# Altium schematic sheet Full bridge-2-Buck drives -9.SchDoc
size A0
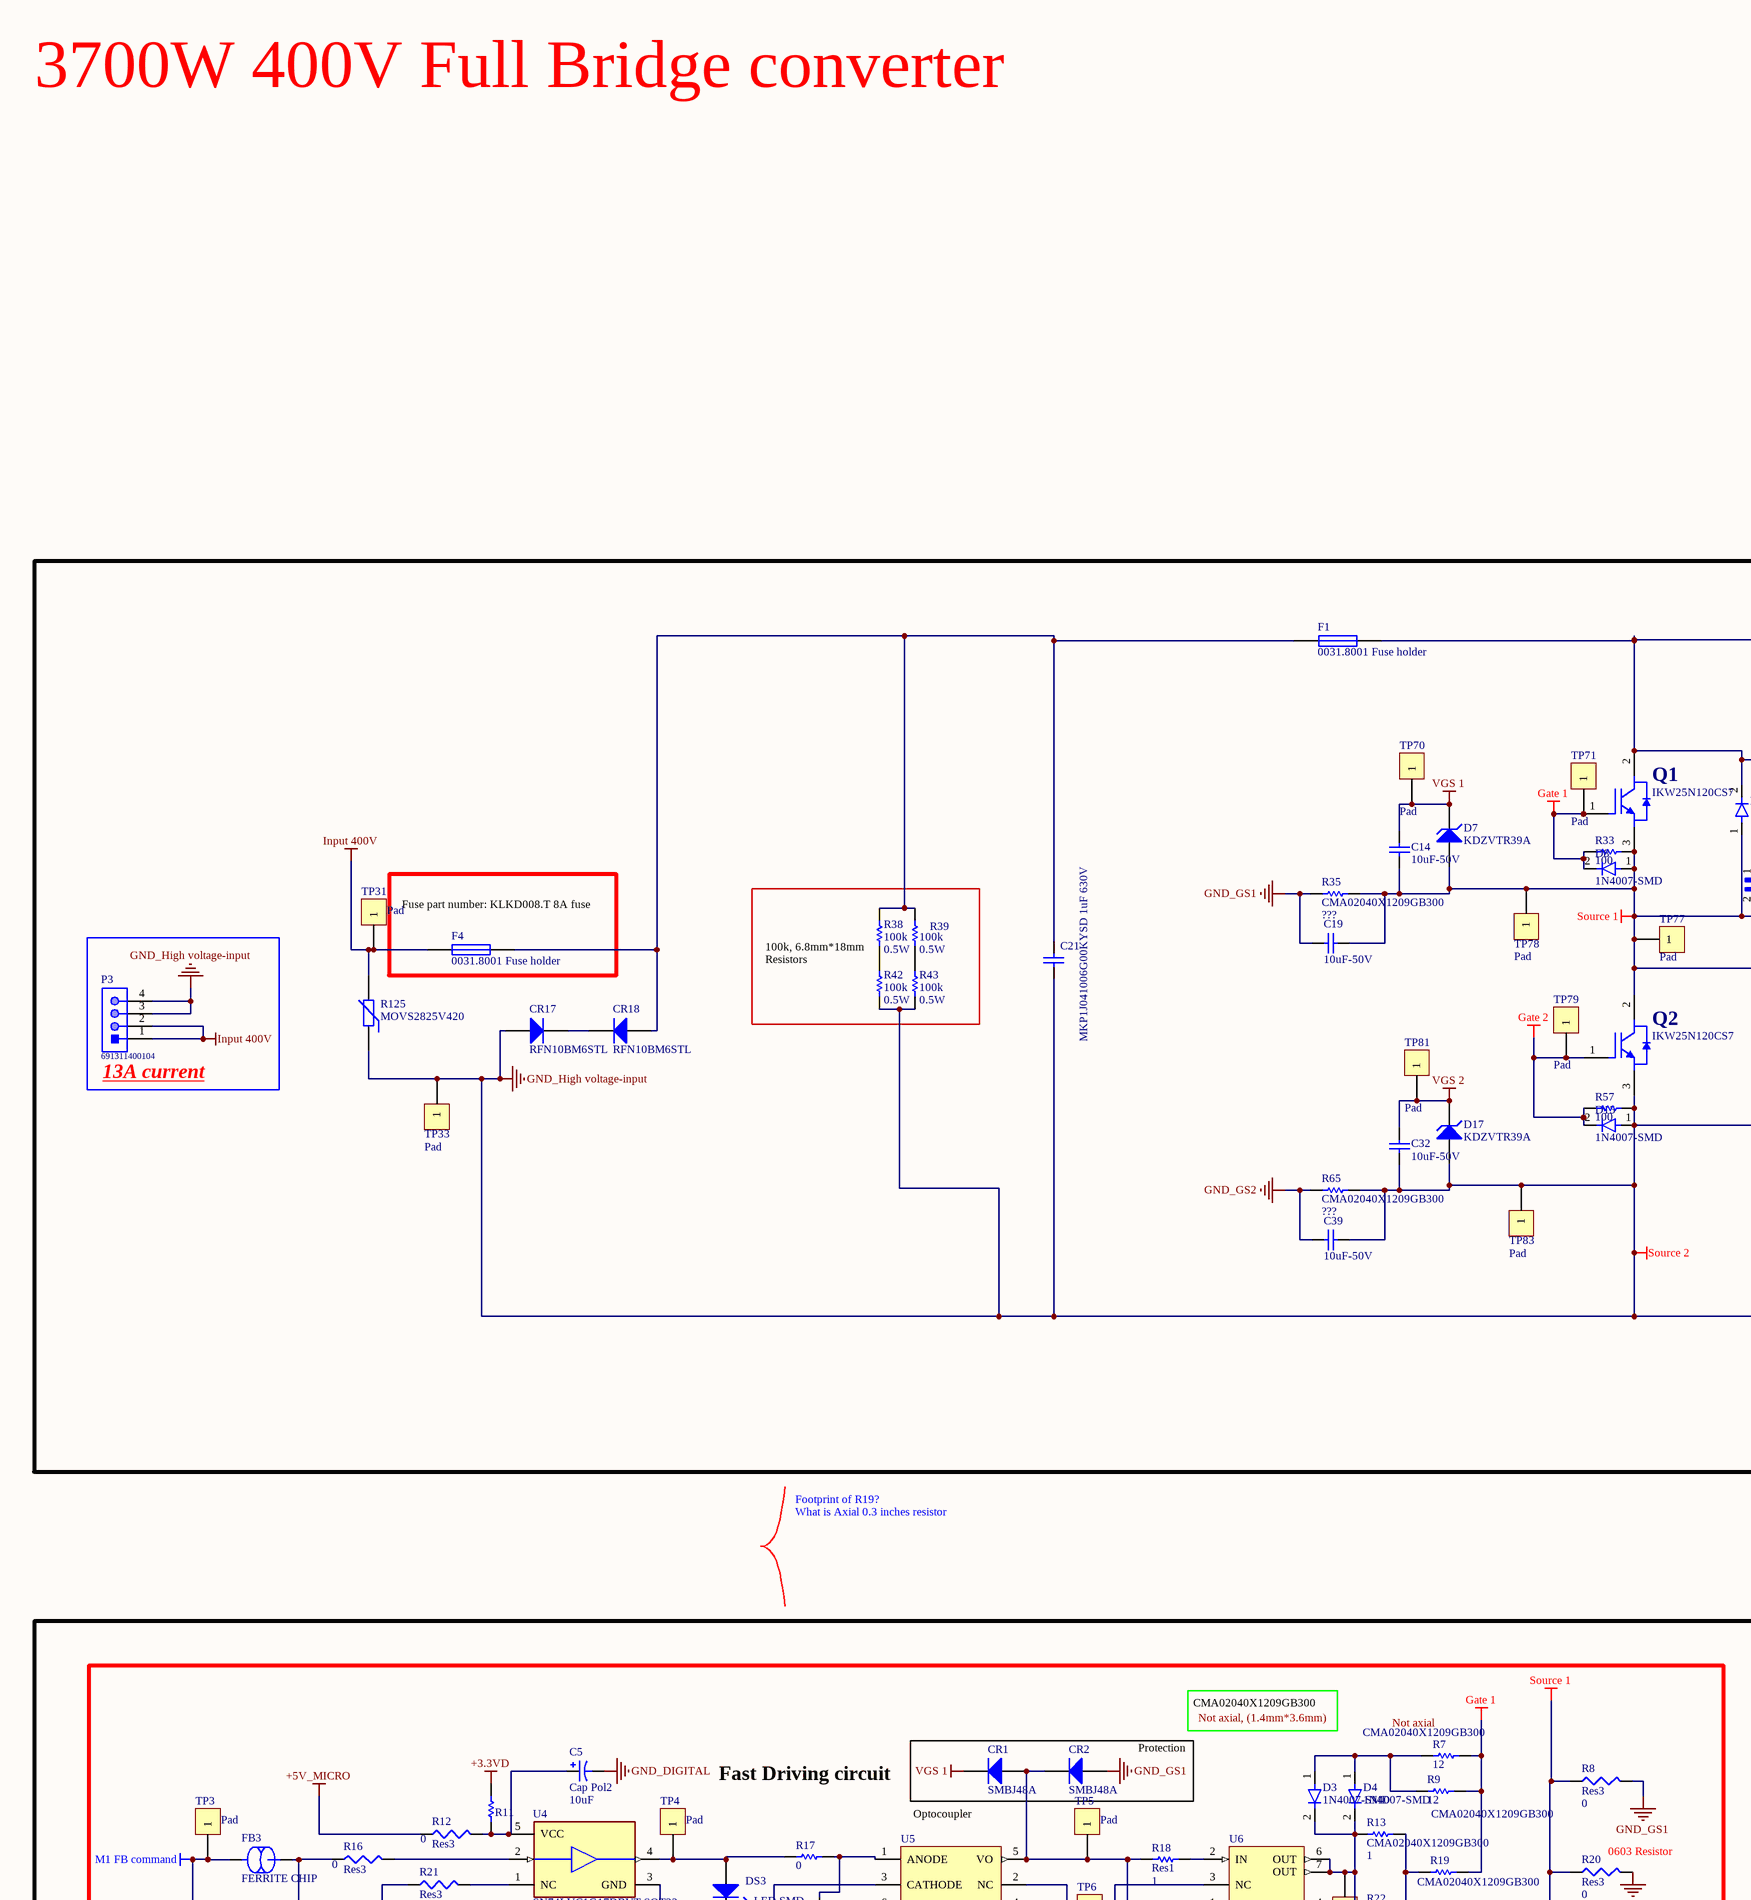
[diagram p0: Full bridge-2-Buck drives -9.SchDoc, top left]
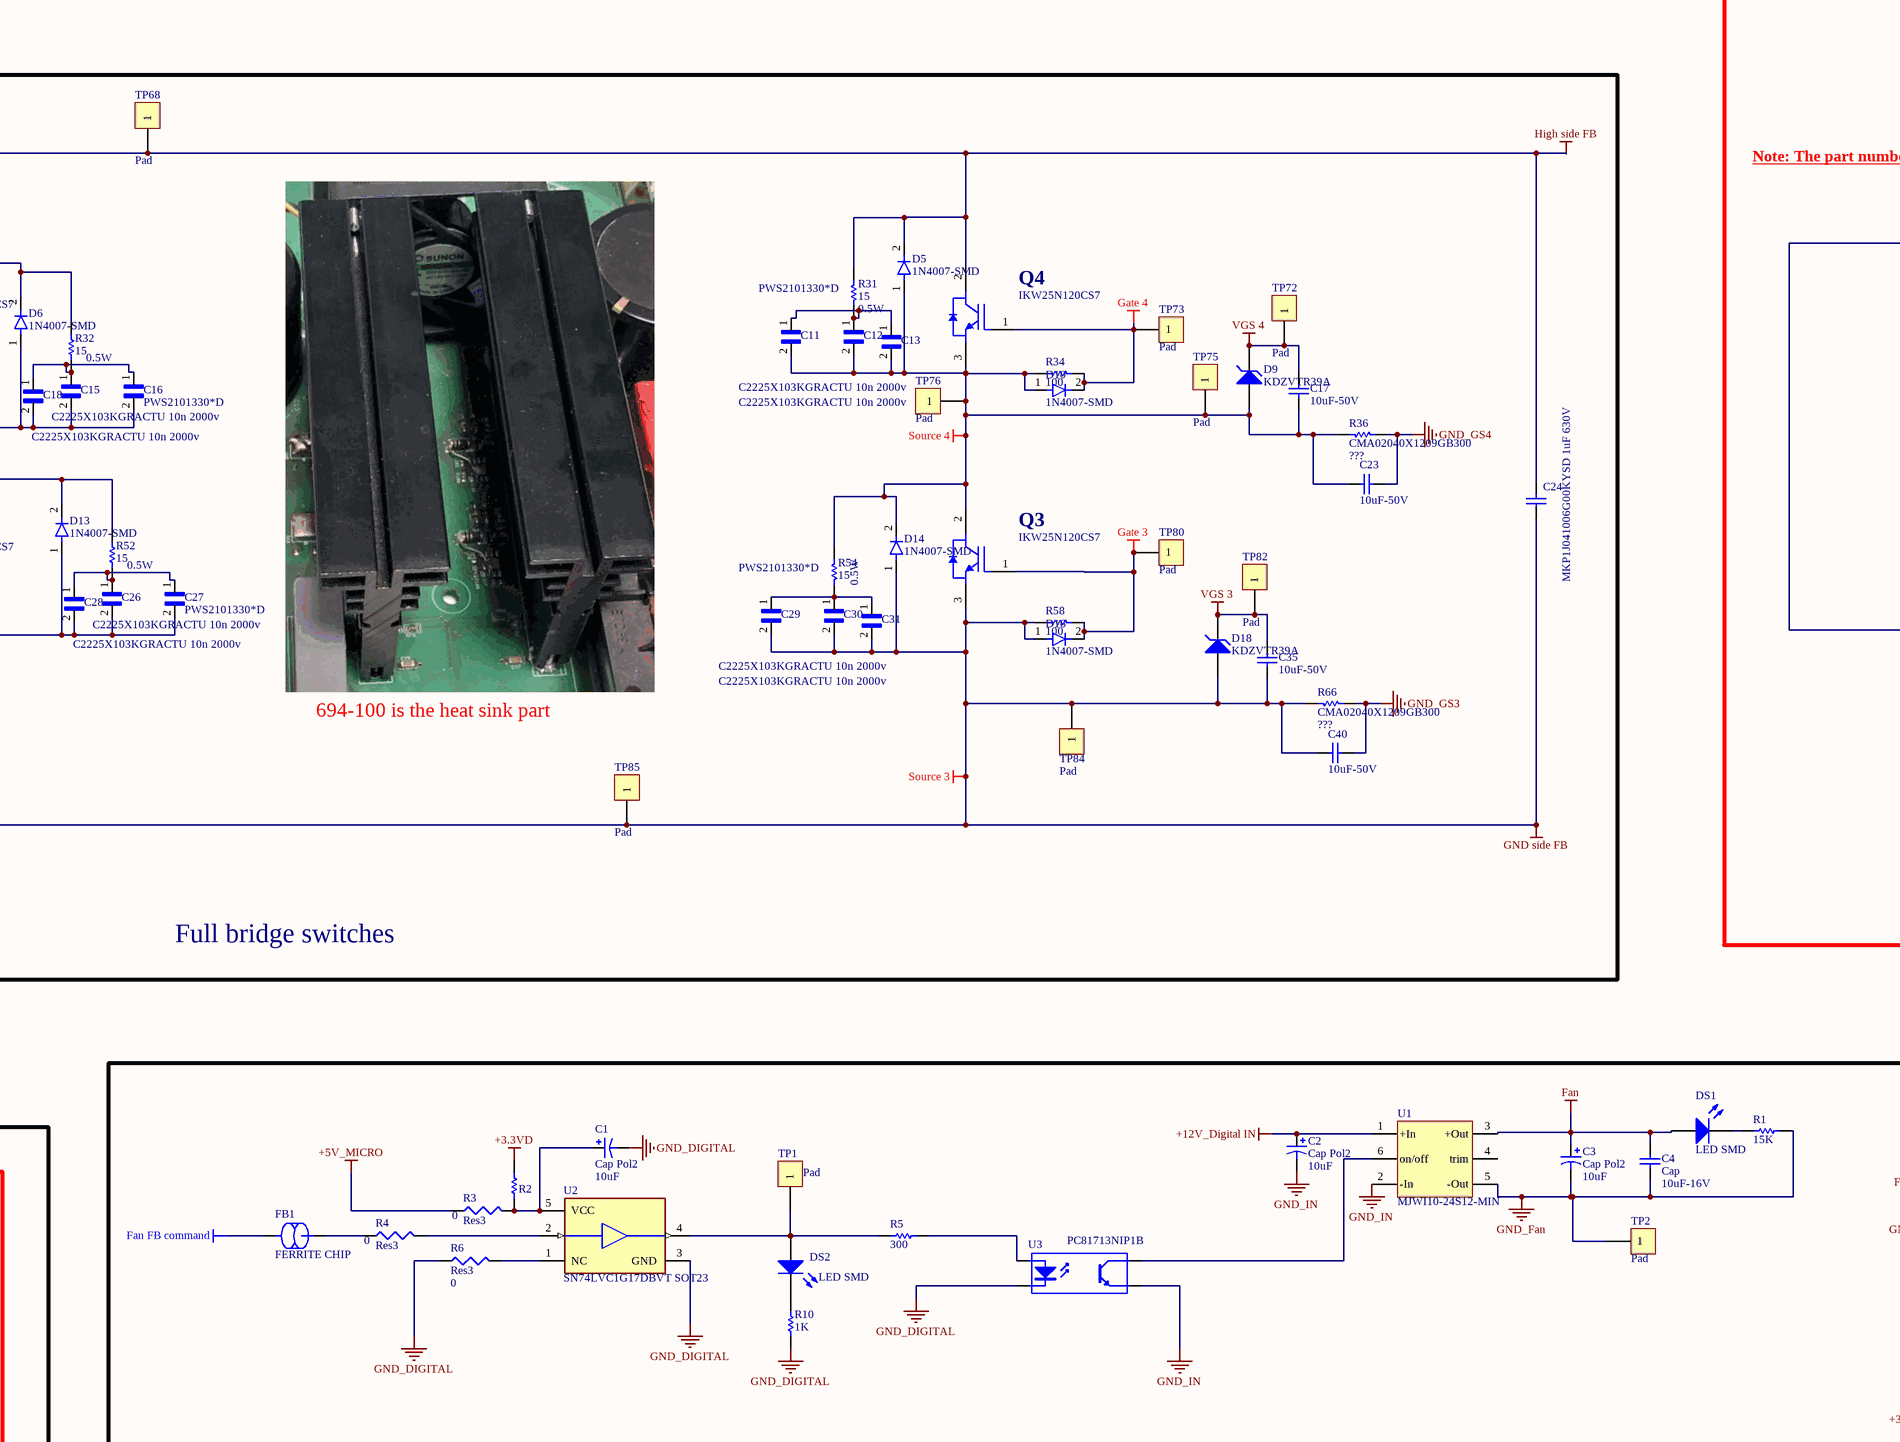
[diagram p1: Full bridge-2-Buck drives -9.SchDoc, top middle]
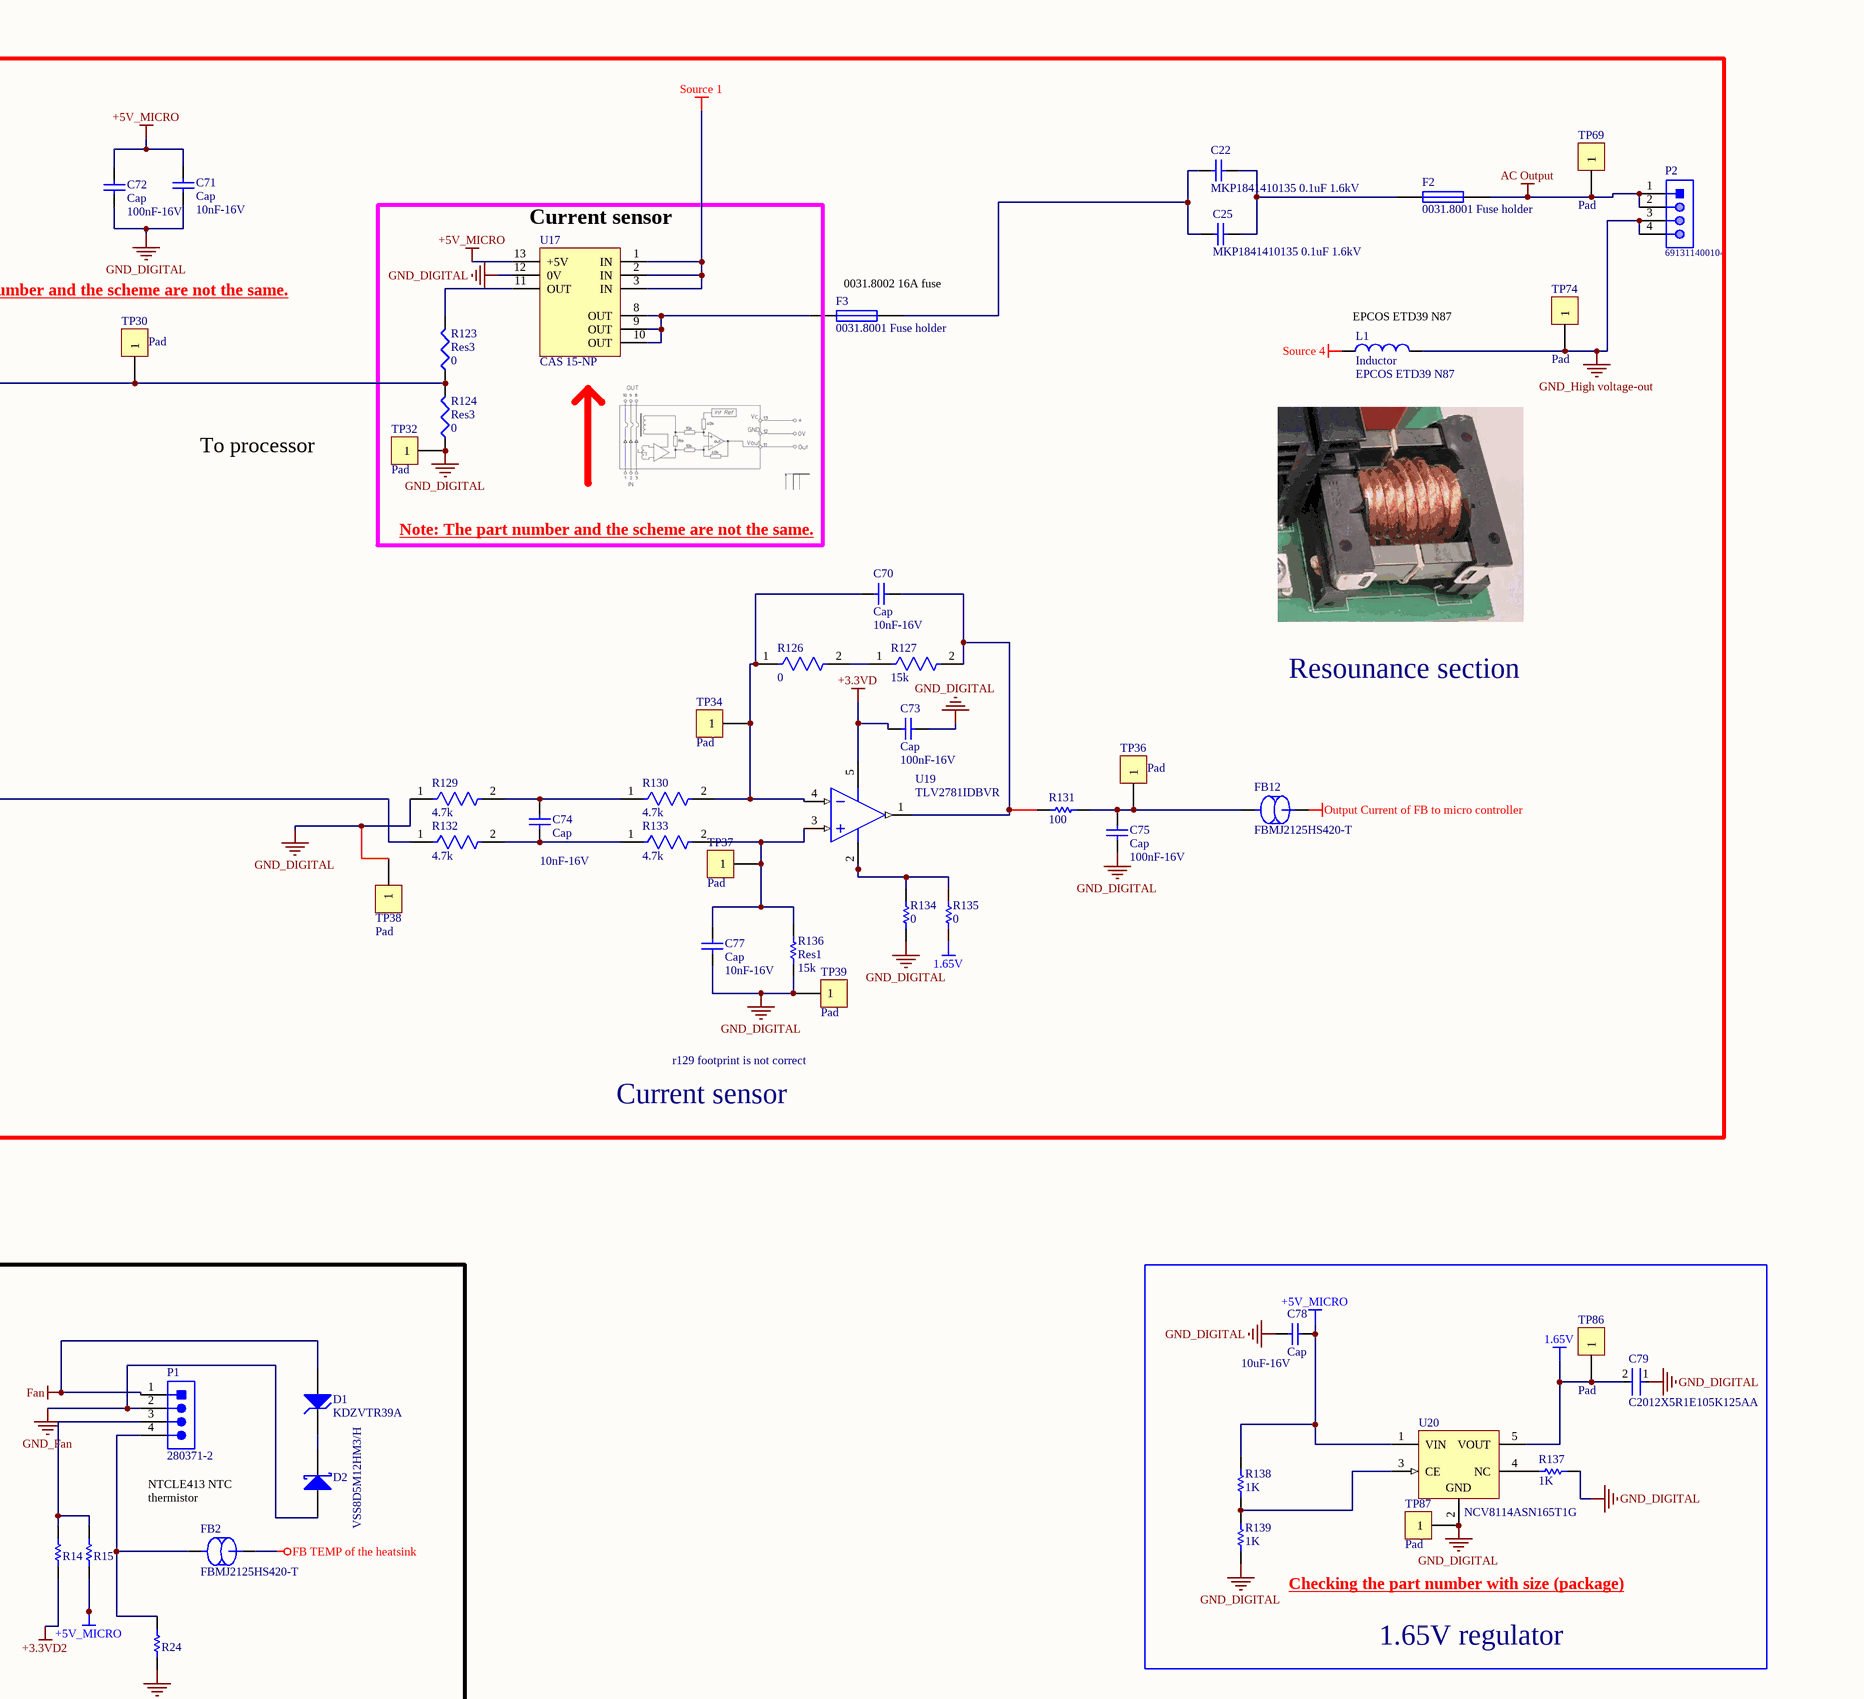
[diagram p2: Full bridge-2-Buck drives -9.SchDoc, top right]
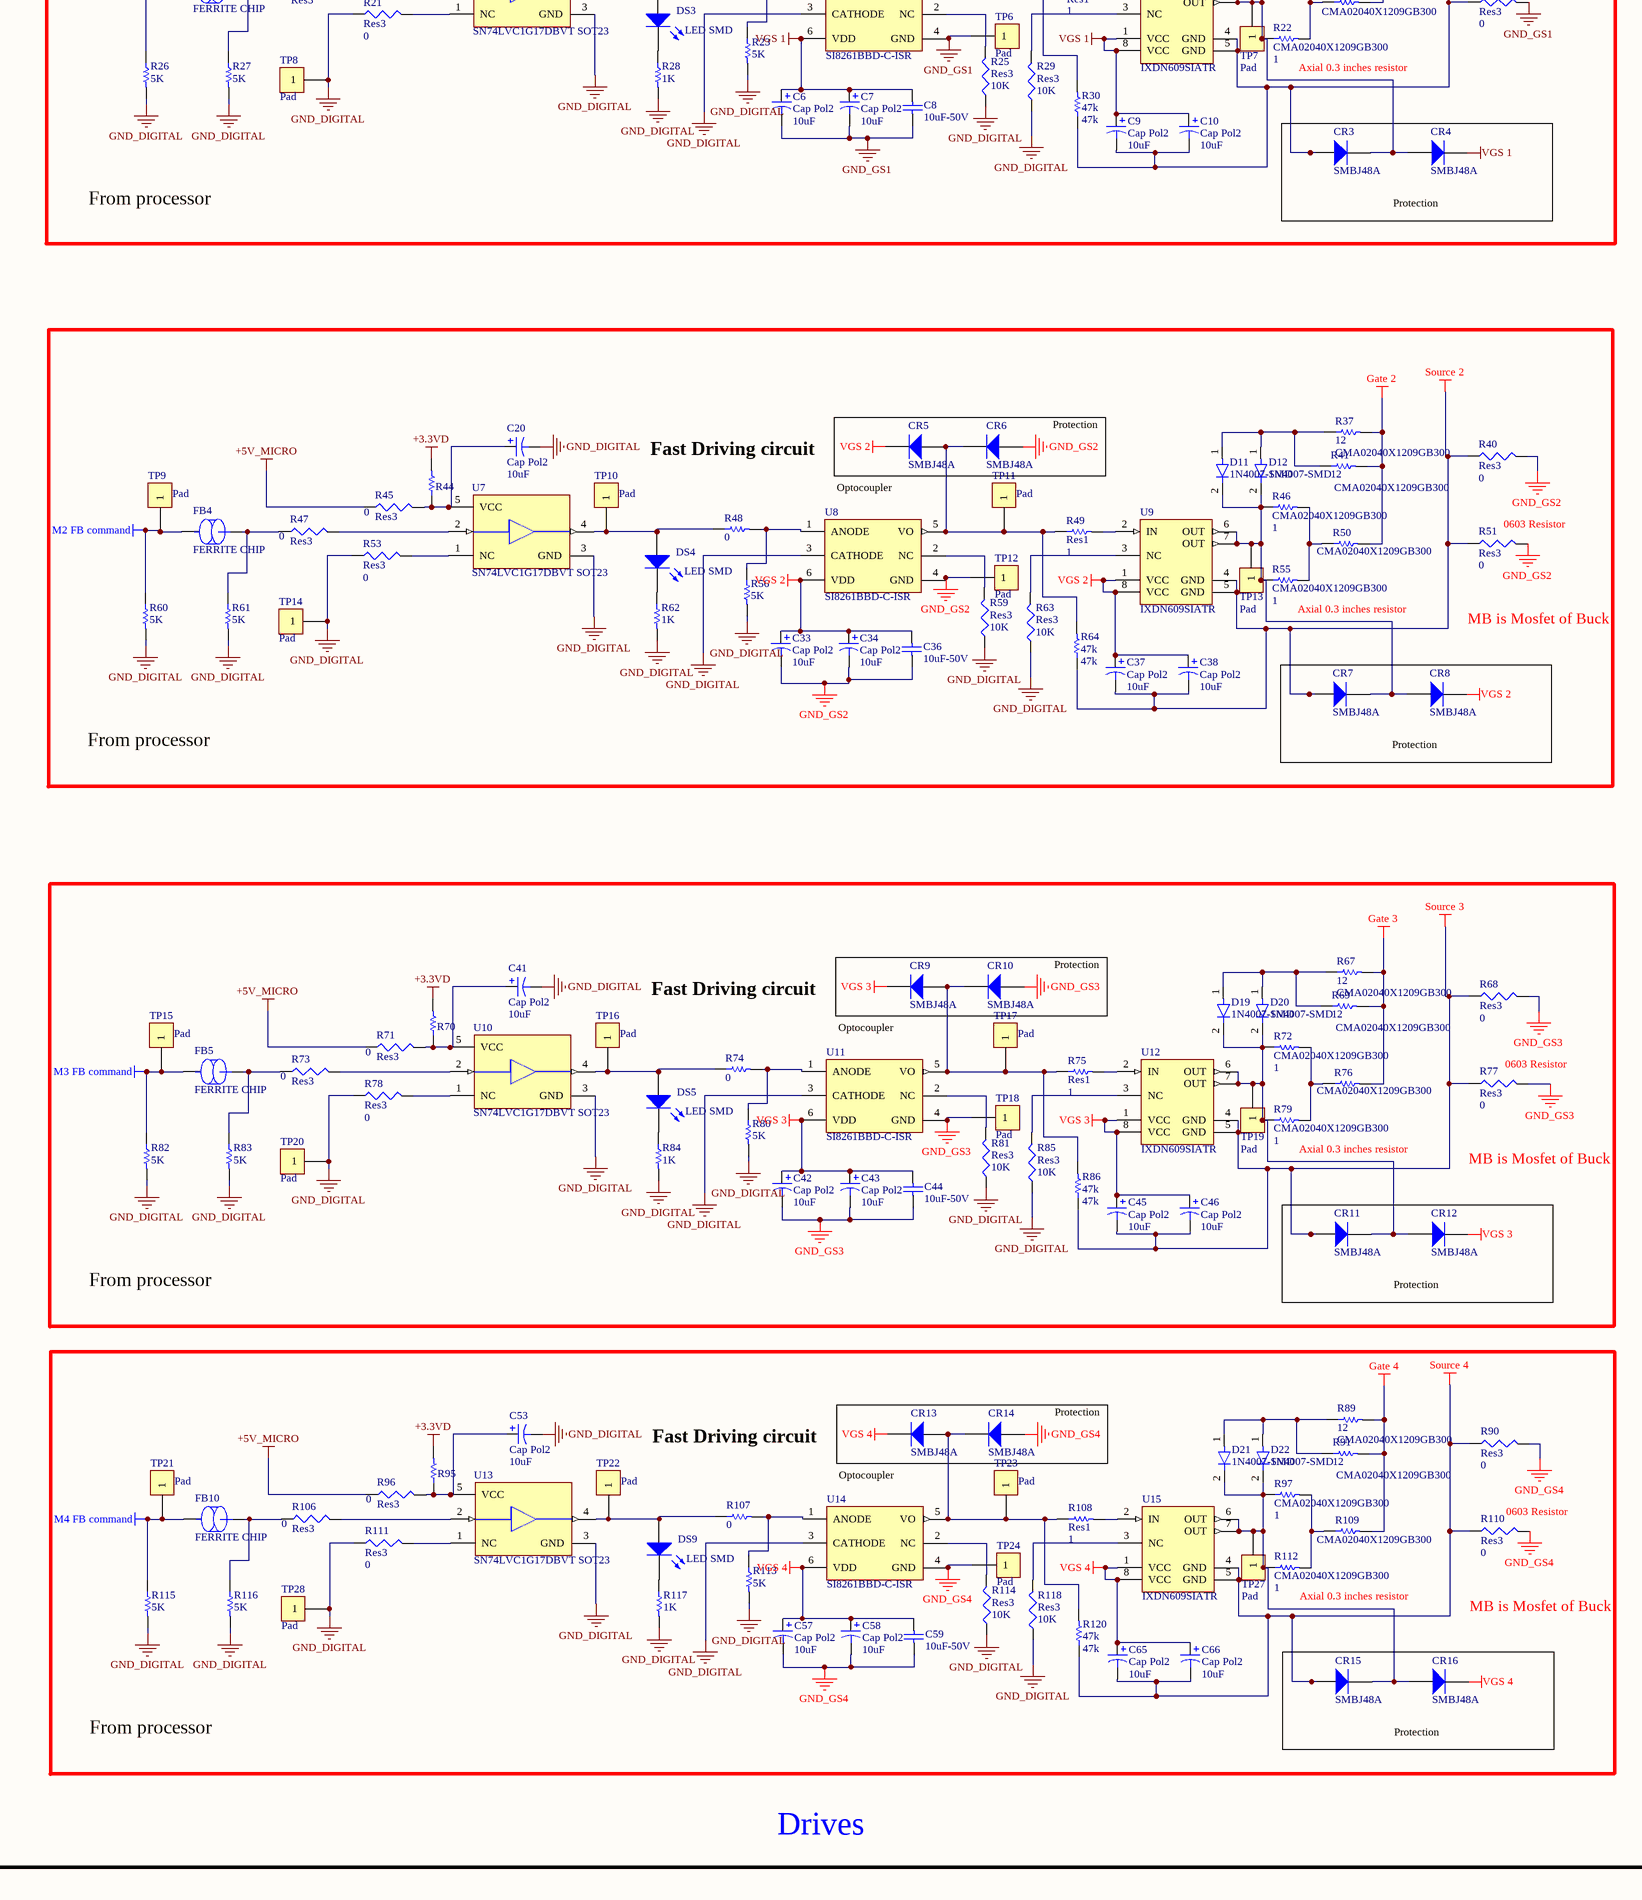
[diagram p3: Full bridge-2-Buck drives -9.SchDoc, bottom left]
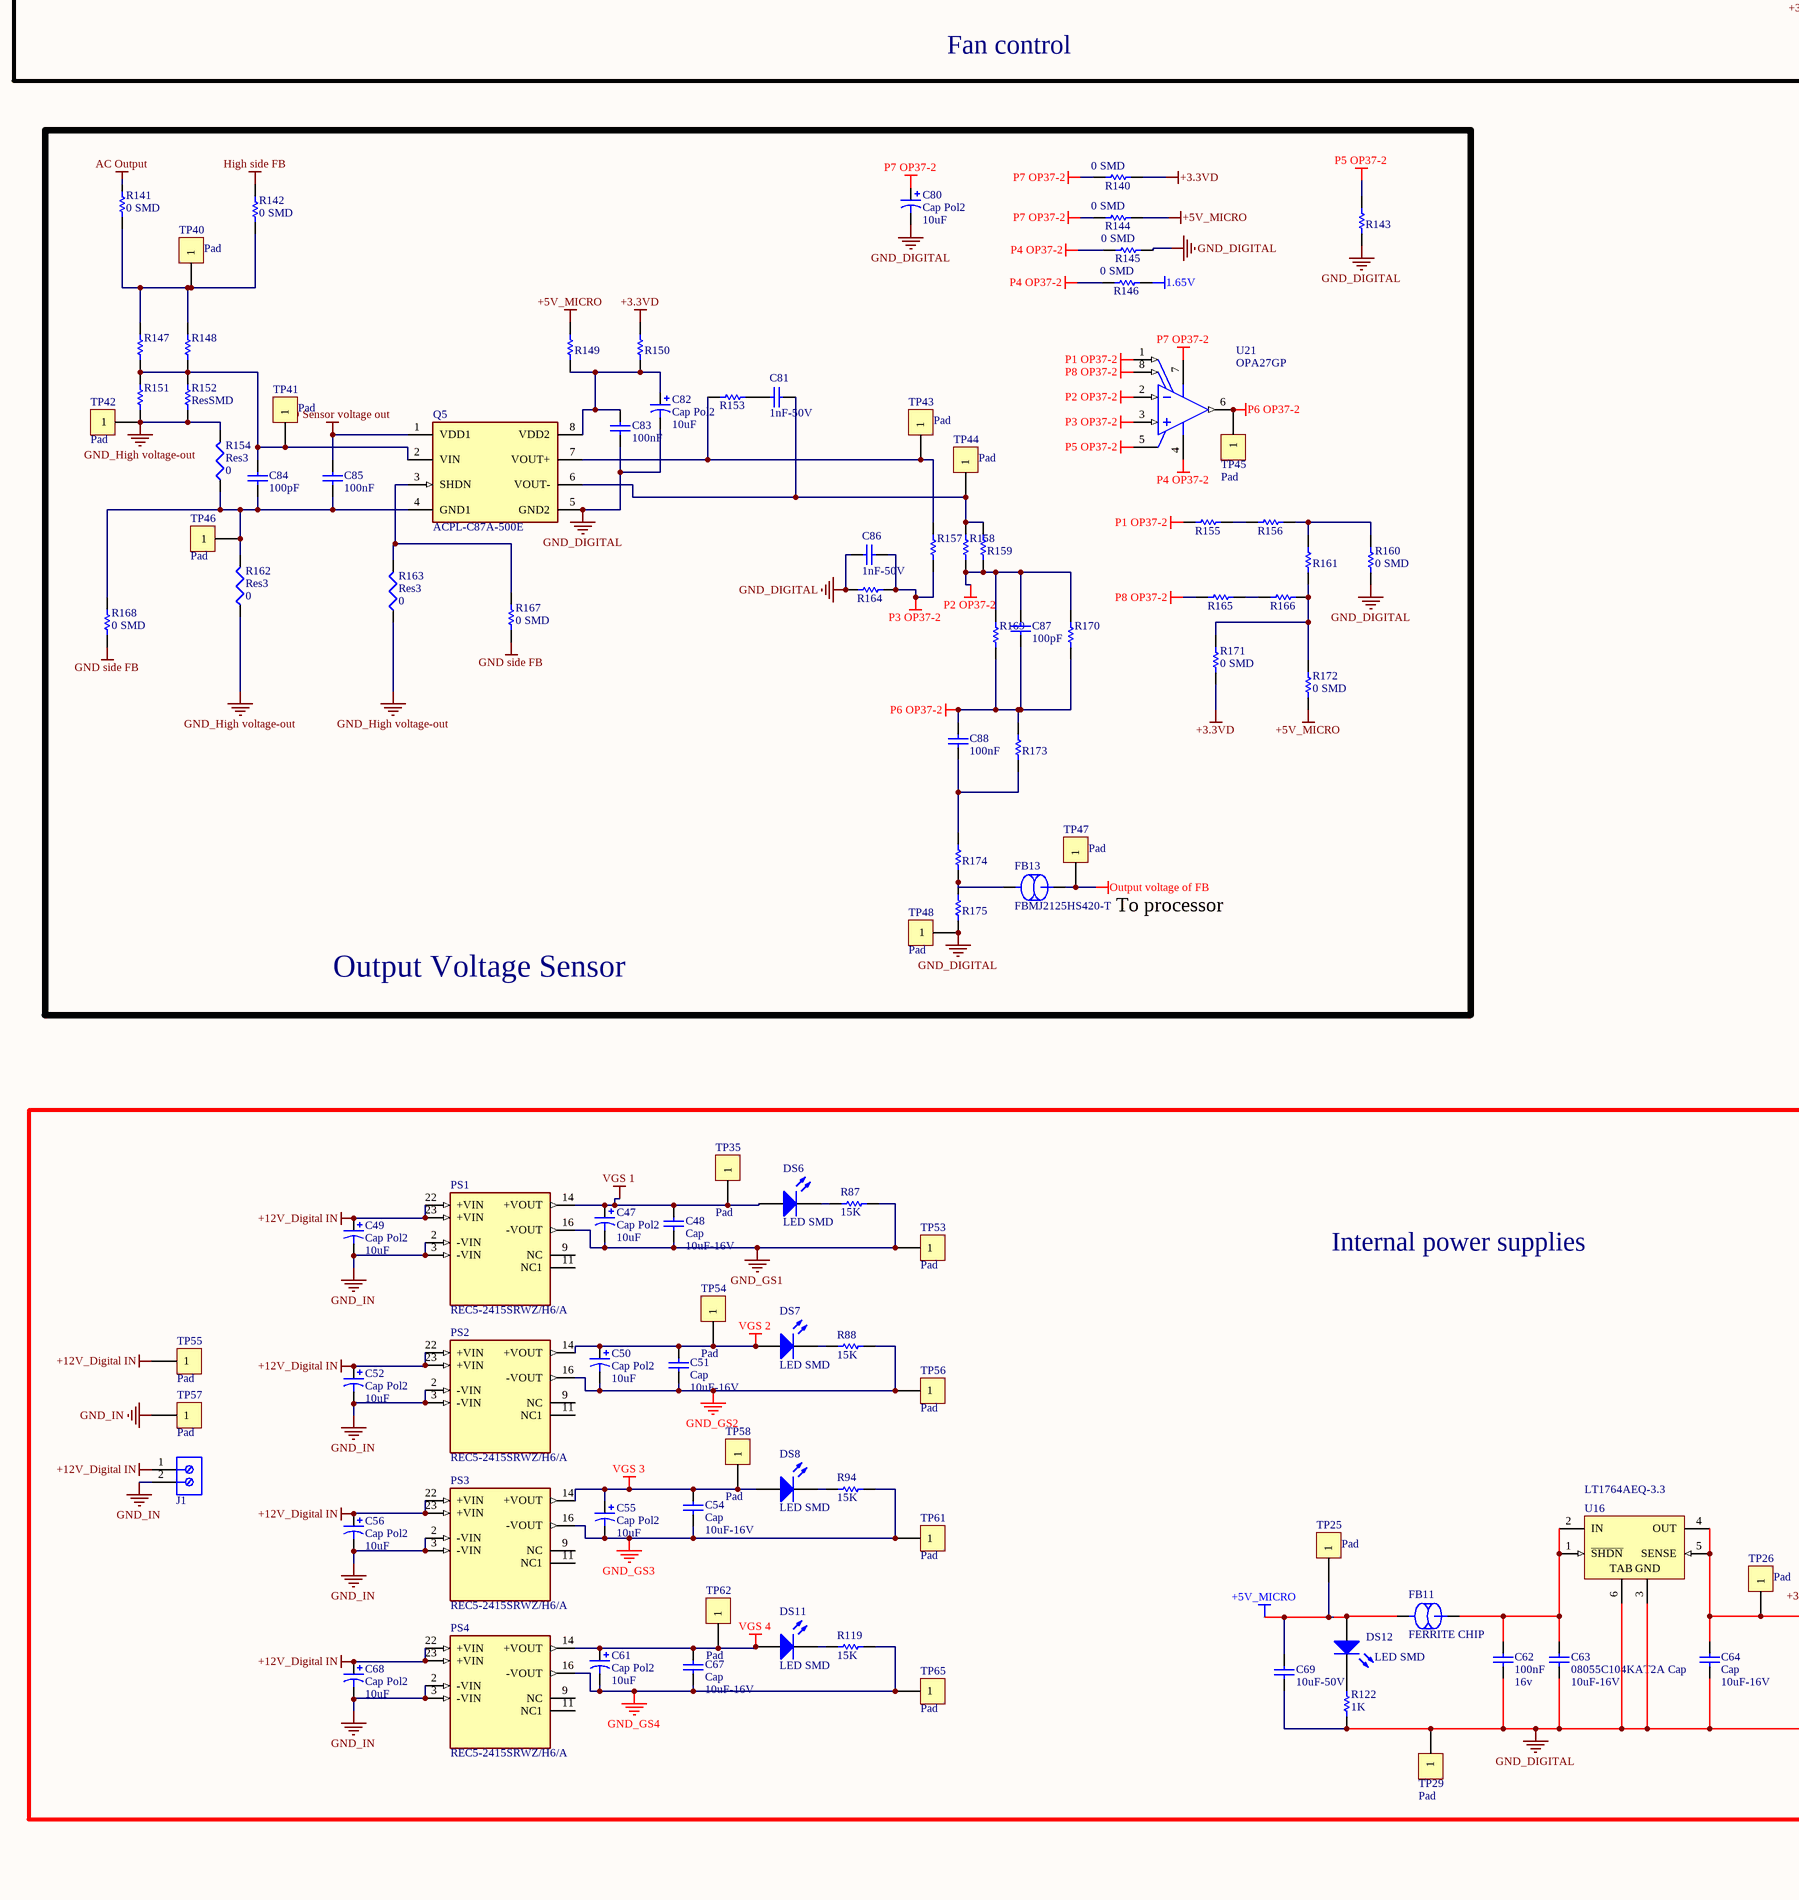
[diagram p4: Full bridge-2-Buck drives -9.SchDoc, bottom middle]
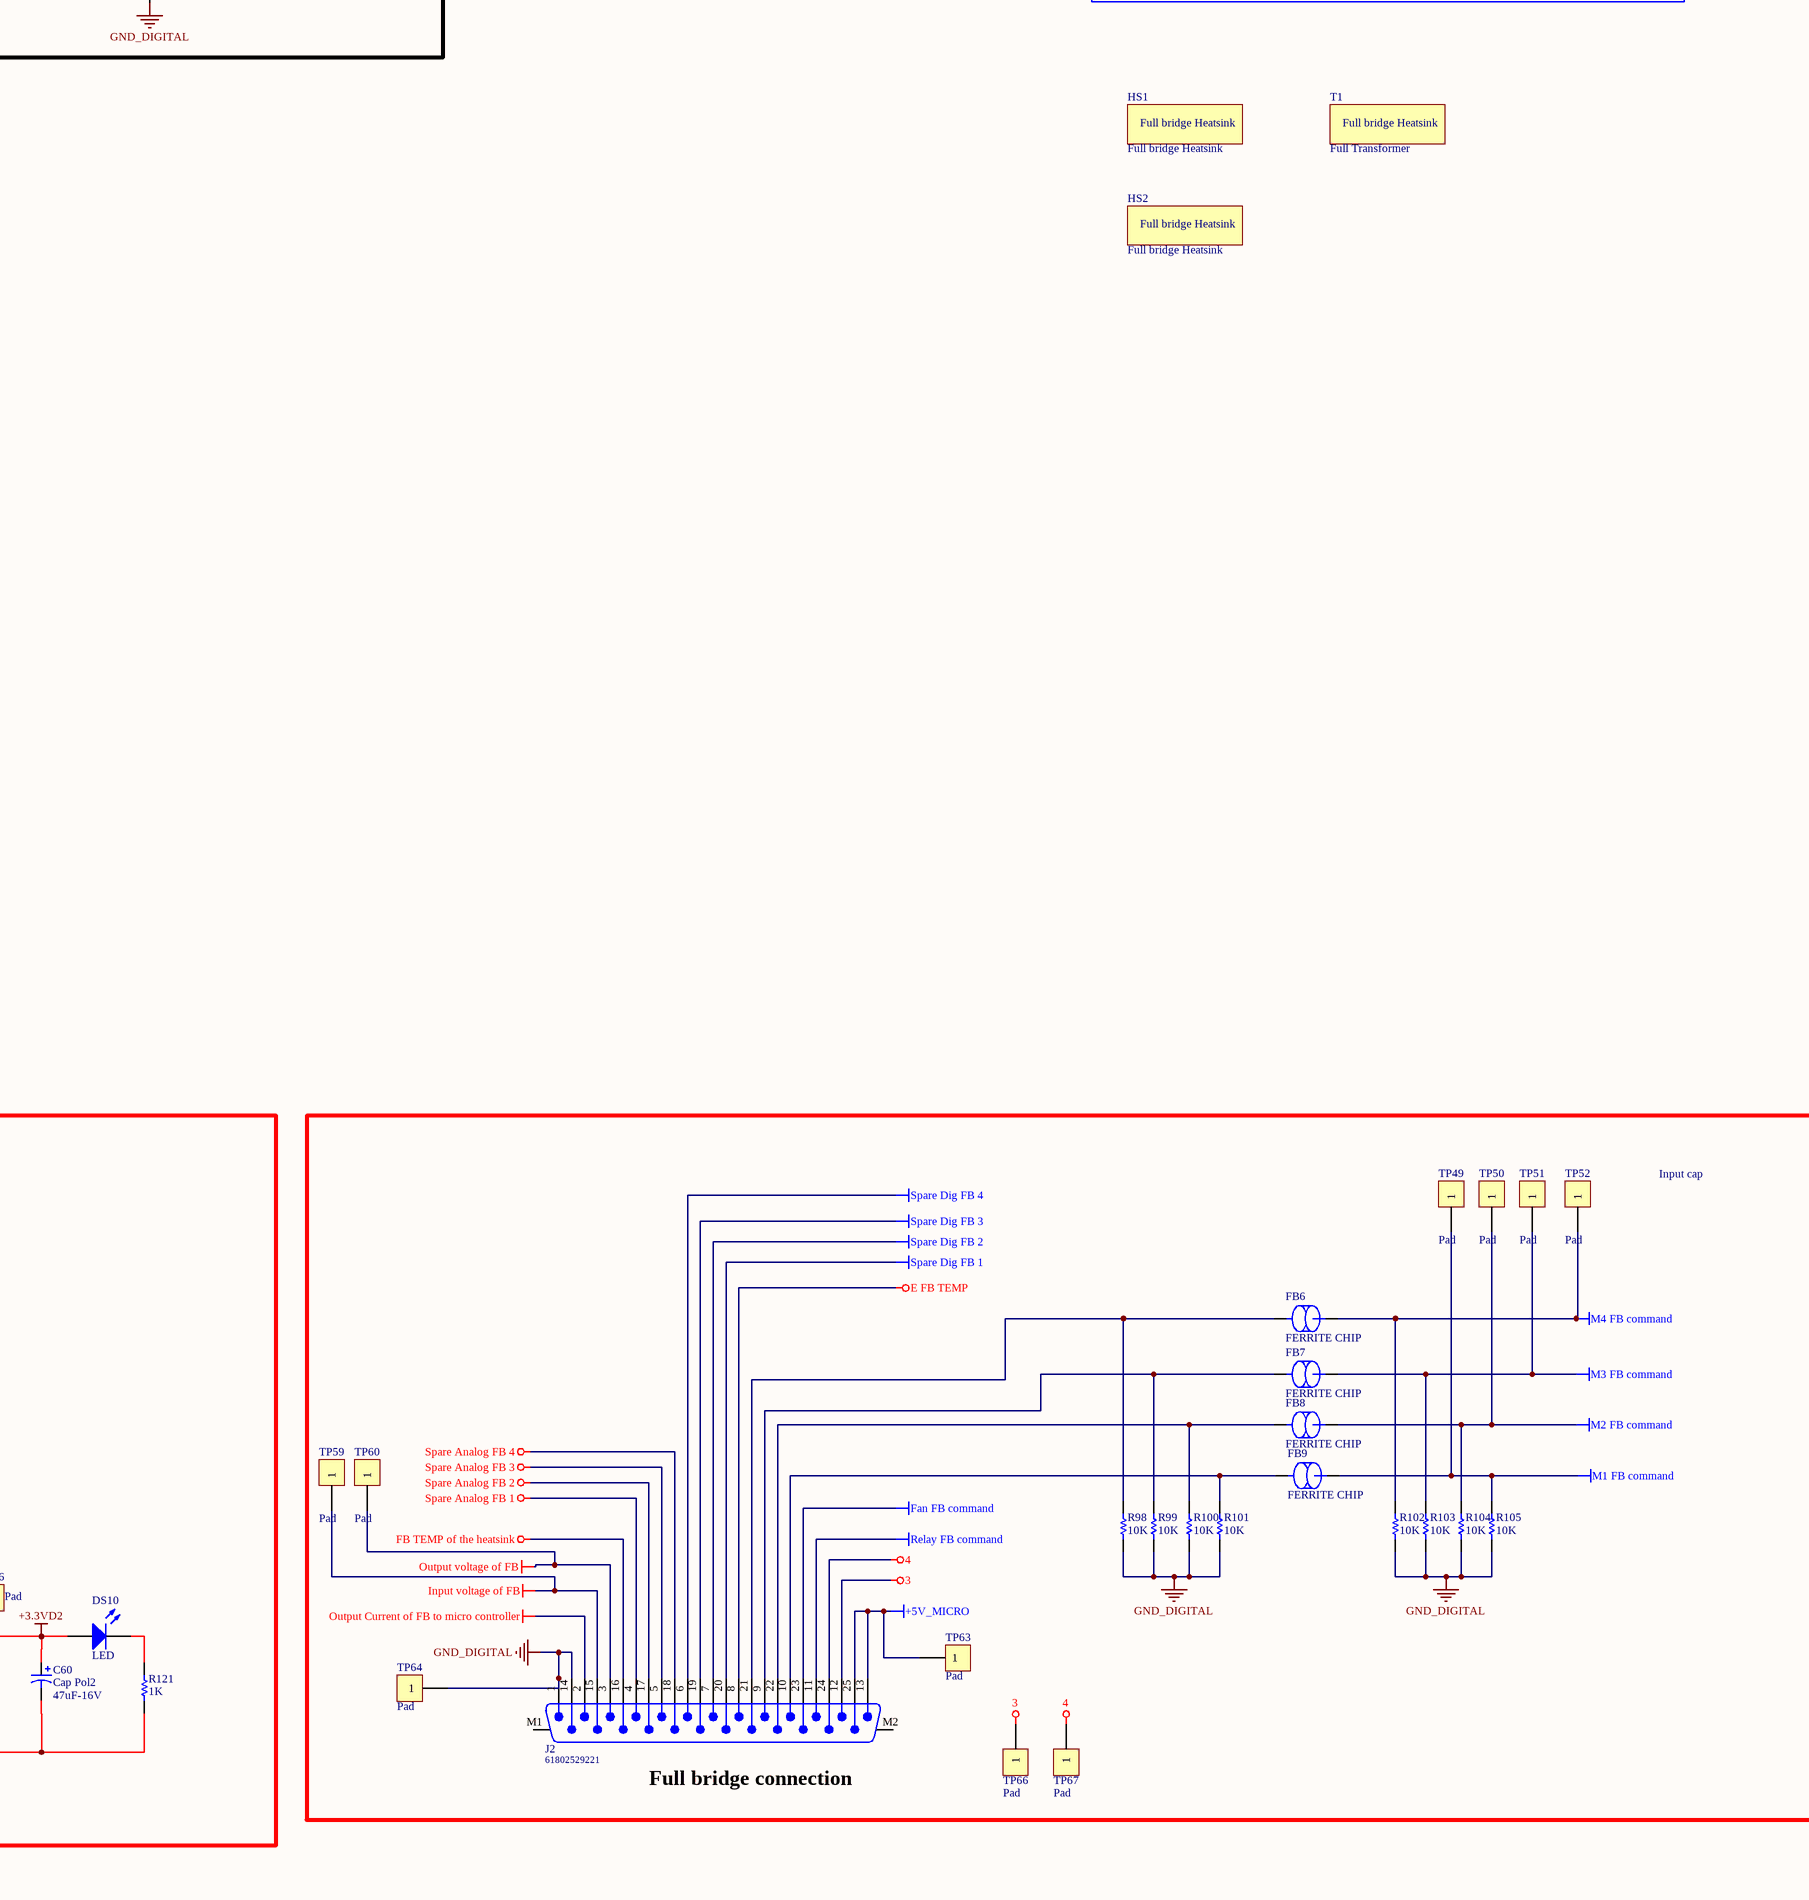
[diagram p5: Full bridge-2-Buck drives -9.SchDoc, bottom right]

## Parts
C1  Cap Pol2  value 10uF  [CAPAE430X565N]
C2  Cap Pol2  value 10uF  [CAPAE430X565N]
C3  Cap Pol2  value 10uF  [CAPAE430X565N]
C4  Cap  value 10uF-16V  [C0805]
C5  Cap Pol2  value 10uF  [CAPAE430X565N]
C6  Cap Pol2  value 10uF  [CAPAE430X565N]
C7  Cap Pol2  value 10uF  [CAPAE430X565N]
C8  10uF-50V  [C0805]
C9  Cap Pol2  value 10uF  [CAPAE430X565N]
C10  Cap Pol2  value 10uF  [CAPAE430X565N]
C11  PWS2101330*D  [PWS2101330KD]
C12  C2225X103KGRACTU 10n 2000v  [C2225]
C13  C2225X103KGRACTU 10n 2000v  [C2225]
C14  10uF-50V  [C0805]
C15  C2225X103KGRACTU 10n 2000v  [C2225]
C16  PWS2101330*D  [PWS2101330KD]
C17  10uF-50V  [C0805]
C18  C2225X103KGRACTU 10n 2000v  [C2225]
C19  10uF-50V  [C0805]
C20  Cap Pol2  value 10uF  [CAPAE430X565N]
C21  MKP1J041006G00KYSD 1uF 630V  [MKP10_31x17-P27.5mm]
C22  MKP1841410135 0.1uF 1.6kV  [MKP1841410135]
C23  10uF-50V  [C0805]
C24  MKP1J041006G00KYSD 1uF 630V  [MKP10_31x17-P27.5mm]
C25  MKP1841410135 0.1uF 1.6kV  [MKP1841410135]
C26  C2225X103KGRACTU 10n 2000v  [C2225]
C27  PWS2101330*D  [PWS2101330KD]
C28  C2225X103KGRACTU 10n 2000v  [C2225]
C29  PWS2101330*D  [PWS2101330KD]
C30  C2225X103KGRACTU 10n 2000v  [C2225]
C31  C2225X103KGRACTU 10n 2000v  [C2225]
C32  10uF-50V  [C0805]
C33  Cap Pol2  value 10uF  [CAPAE430X565N]
C34  Cap Pol2  value 10uF  [CAPAE430X565N]
C35  10uF-50V  [C0805]
C36  10uF-50V  [C0805]
C37  Cap Pol2  value 10uF  [CAPAE430X565N]
C38  Cap Pol2  value 10uF  [CAPAE430X565N]
C39  10uF-50V  [C0805]
C40  10uF-50V  [C0805]
C41  Cap Pol2  value 10uF  [CAPAE430X565N]
C42  Cap Pol2  value 10uF  [CAPAE430X565N]
C43  Cap Pol2  value 10uF  [CAPAE430X565N]
C44  10uF-50V  [C0805]
C45  Cap Pol2  value 10uF  [CAPAE430X565N]
C46  Cap Pol2  value 10uF  [CAPAE430X565N]
C47  Cap Pol2  value 10uF  [CAPAE430X565N]
C48  Cap  value 10uF-16V  [C0805]
C49  Cap Pol2  value 10uF  [CAPAE430X565N]
C50  Cap Pol2  value 10uF  [CAPAE430X565N]
C51  Cap  value 10uF-16V  [C0805]
C52  Cap Pol2  value 10uF  [CAPAE430X565N]
C53  Cap Pol2  value 10uF  [CAPAE430X565N]
C54  Cap  value 10uF-16V  [C0805]
C55  Cap Pol2  value 10uF  [CAPAE430X565N]
C56  Cap Pol2  value 10uF  [CAPAE430X565N]
C57  Cap Pol2  value 10uF  [CAPAE430X565N]
C58  Cap Pol2  value 10uF  [CAPAE430X565N]
C59  10uF-50V  [C0805]
C60  Cap Pol2  value 47uF-16V  [CAPAE430X565N]
C61  Cap Pol2  value 10uF  [CAPAE430X565N]
C62  Volte: 16v  [C0805]  (hidden comment: 100nF)
C63  08055C104KAT2A Cap  value 10uF-16V  [C0805]
C64  Cap  value 10uF-16V  [C0805]
C65  Cap Pol2  value 10uF  [CAPAE430X565N]
C66  Cap Pol2  value 10uF  [CAPAE430X565N]
C67  Cap  value 10uF-16V  [C0805]
C68  Cap Pol2  value 10uF  [CAPAE430X565N]
C69  10uF-50V  [C0805]
C70  Cap  value 10nF-16V  [C0805]
C71  Cap  value 10nF-16V  [C0805]
C72  Cap  value 100nF-16V  [C0805]
C73  Cap  value 100nF-16V  [C0805]
C74  Cap  value 10nF-16V  [C0805]
C75  Cap  value 100nF-16V  [C0805]
C77  Cap  value 10nF-16V  [C0805]
C78  Cap  value 10uF-16V  [C0805]
C79  C2012X5R1E105K125AA  [C0805]
C80  Cap Pol2  value 10uF  [C0805]
C81  1nF-50V  [C0805]
C82  Cap Pol2  value 10uF  [C0805]
C83  100nF  [C0805]
C84  100pF  [C0805]
C85  100nF  [C0805]
C86  1nF-50V  [C0805]
C87  100pF  [C0805]
C88  100nF  [C0805]
CR1  SMBJ48A  [SMB (DO-214AA)]
CR2  SMBJ48A  [SMB (DO-214AA)]
CR3  SMBJ48A  [SMB (DO-214AA)]
CR4  SMBJ48A  [SMB (DO-214AA)]
CR5  SMBJ48A  [SMB (DO-214AA)]
CR6  SMBJ48A  [SMB (DO-214AA)]
CR7  SMBJ48A  [SMB (DO-214AA)]
CR8  SMBJ48A  [SMB (DO-214AA)]
CR9  SMBJ48A  [SMB (DO-214AA)]
CR10  SMBJ48A  [SMB (DO-214AA)]
CR11  SMBJ48A  [SMB (DO-214AA)]
CR12  SMBJ48A  [SMB (DO-214AA)]
CR13  SMBJ48A  [SMB (DO-214AA)]
CR14  SMBJ48A  [SMB (DO-214AA)]
CR15  SMBJ48A  [SMB (DO-214AA)]
CR16  SMBJ48A  [SMB (DO-214AA)]
CR17  RFN10BM6STL  [RFN10BM]
CR18  RFN10BM6STL  [RFN10BM]
D1  KDZVTR39A  [SOD-123FL]
D2  VSS8D5M12HM3/H  [DO-221AD]
D3  1N4007-SMD  [SMA (DO-214AC)]
D4  1N4007-SMD  [SMA (DO-214AC)]
D5  1N4007-SMD  [SMA (DO-214AC)]
D6  1N4007-SMD  [SMA (DO-214AC)]
D7  KDZVTR39A  [SOD-123FL]
D8  1N4007-SMD  [SMA (DO-214AC)]
D9  KDZVTR39A  [SOD-123FL]
D10  1N4007-SMD  [SMA (DO-214AC)]
D11  1N4007-SMD  [SMA (DO-214AC)]
D12  1N4007-SMD  [SMA (DO-214AC)]
D13  1N4007-SMD  [SMA (DO-214AC)]
D14  1N4007-SMD  [SMA (DO-214AC)]
D15  1N4007-SMD  [SMA (DO-214AC)]
D16  1N4007-SMD  [SMA (DO-214AC)]
D17  KDZVTR39A  [SOD-123FL]
D18  KDZVTR39A  [SOD-123FL]
D19  1N4007-SMD  [SMA (DO-214AC)]
D20  1N4007-SMD  [SMA (DO-214AC)]
D21  1N4007-SMD  [SMA (DO-214AC)]
D22  1N4007-SMD  [SMA (DO-214AC)]
DS1  LED SMD  [LED0805]
DS2  LED SMD  [LED0805]
DS3  LED SMD  [LED0805]
DS4  LED SMD  [LED0805]
DS5  LED SMD  [LED0805]
DS6  LED SMD  [LED0805]
DS7  LED SMD  [LED0805]
DS8  LED SMD  [LED0805]
DS9  LED SMD  [LED0805]
DS10  LED  [LED0805]
DS11  LED SMD  [LED0805]
DS12  LED SMD  [LED0805]
F1  0031.8001 Fuse holder  [00318001]
F2  0031.8001 Fuse holder  [00318001]
F3  0031.8001 Fuse holder  [00318001]
F4  0031.8001 Fuse holder  [00318001]
FB1  FERRITE CHIP  [L0805]
FB2  FBMJ2125HS420-T  [L0805]
FB3  FERRITE CHIP  [L0805]
FB4  FERRITE CHIP  [L0805]
FB5  FERRITE CHIP  [L0805]
FB6  FERRITE CHIP  [L0805]
FB7  FERRITE CHIP  [L0805]
FB8  FERRITE CHIP  [L0805]
FB9  FERRITE CHIP  [L0805]
FB10  FERRITE CHIP  [L0805]
FB11  FERRITE CHIP  [L0805]
FB12  FBMJ2125HS420-T  [L0805]
FB13  FBMJ2125HS420-T  [L0805]
HS1  Full bridge Heatsink  [Full_bridge_Heatsink]
HS2  Full bridge Heatsink  [Full_bridge_Heatsink]
J1  691101710002  [691101710002]  (value not drawn)
J2  61802529221  [61802525123]
L1  Inductor  value EPCOS ETD39 N87  [FullBridge_Inductor]
P1  280371-2  [TECO-280371-2_V]
P2  691311400104  [691311400104]
P3  691311400104  [691311400104]
PS1  REC5-2415SRWZ/H6/A  [REC52415SRWZH6A]
PS2  REC5-2415SRWZ/H6/A  [REC52415SRWZH6A]
PS3  REC5-2415SRWZ/H6/A  [REC52415SRWZH6A]
PS4  REC5-2415SRWZ/H6/A  [REC52415SRWZH6A]
Q1  IKW25N120CS7  [PG-TO247-3]
Q2  IKW25N120CS7  [PG-TO247-3]
Q3  IKW25N120CS7  [PG-TO247-3]
Q4  IKW25N120CS7  [PG-TO247-3]
Q5  ACPL-C87A-500E  [FP-SSO-8-MFG]
R1  15K  [R0805]
R2  ResSMD  [R0805]  (value not drawn)
R3  Res3  value 0  [R0603]
R4  Res3  value 0  [R0603]
R5  300  [R0805]
R6  Res3  value 0  [R0603]
R7  12  value CMA02040X1209GB300  [MELF 0204]
R8  Res3  value 0  [R0603]
R9  12  value CMA02040X1209GB300  [MELF 0204]
R10  1K  [R0805]
R11  ResSMD  [R0805]  (value not drawn)
R12  Res3  value 0  [R0603]
R13  CMA02040X1209GB300  value 1  [MMF50S]
R14  ResSMD  [R0805]  (value not drawn)
R15  ResSMD  [R0805]  (value not drawn)
R16  Res3  value 0  [R0603]
R17  0  [R0805]
R18  Res1  value 1  [R0805]
R19  CMA02040X1209GB300  [MELF 0204]
R20  Res3  value 0  [R0603]
R21  Res3  value 0  [R0603]
R22  CMA02040X1209GB300  value 1  [MMF50S]
R23  5K  [R0805]
R24  ResSMD  [R0805]  (value not drawn)
R25  Res3  value 10K  [R0603]
R26  5K  [R0805]
R27  5K  [R0805]
R28  1K  [R0805]
R29  Res3  value 10K  [R0603]
R30  47k  [R0805]
R31  15  value 0.5W  [AXIAL-0.5]
R32  15  value 0.5W  [AXIAL-0.5]
R33  100  [R0805]
R34  100  [R0805]
R35  CMA02040X1209GB300  value ???  [MMF50S]
R36  CMA02040X1209GB300  value ???  [MMF50S]
R37  12  value CMA02040X1209GB300  [MELF 0204]
R38  100k  value 0.5W  [AXIAL0.9-VR68]
R39  100k  value 0.5W  [AXIAL0.9-VR68]
R40  Res3  value 0  [R0603]
R41  12  value CMA02040X1209GB300  [MELF 0204]
R42  100k  value 0.5W  [AXIAL0.9-VR68]
R43  100k  value 0.5W  [AXIAL0.9-VR68]
R44  ResSMD  [R0805]  (value not drawn)
R45  Res3  value 0  [R0603]
R46  CMA02040X1209GB300  value 1  [MMF50S]
R47  Res3  value 0  [R0603]
R48  0  [R0805]
R49  Res1  value 1  [R0805]
R50  CMA02040X1209GB300  [MELF 0204]
R51  Res3  value 0  [R0603]
R52  15  value 0.5W  [AXIAL-0.5]
R53  Res3  value 0  [R0603]
R54  15  value 0.5W  [AXIAL-0.5]
R55  CMA02040X1209GB300  value 1  [MMF50S]
R56  5K  [R0805]
R57  100  [R0805]
R58  100  [R0805]
R59  Res3  value 10K  [R0603]
R60  5K  [R0805]
R61  5K  [R0805]
R62  1K  [R0805]
R63  Res3  value 10K  [R0603]
R64  47k  [R0805]
R65  CMA02040X1209GB300  value ???  [MMF50S]
R66  CMA02040X1209GB300  value ???  [MMF50S]
R67  12  value CMA02040X1209GB300  [MELF 0204]
R68  Res3  value 0  [R0603]
R69  12  value CMA02040X1209GB300  [MELF 0204]
R70  ResSMD  [R0805]  (value not drawn)
R71  Res3  value 0  [R0603]
R72  CMA02040X1209GB300  value 1  [MMF50S]
R73  Res3  value 0  [R0603]
R74  0  [R0805]
R75  Res1  value 1  [R0805]
R76  CMA02040X1209GB300  [MELF 0204]
R77  Res3  value 0  [R0603]
R78  Res3  value 0  [R0603]
R79  CMA02040X1209GB300  value 1  [MMF50S]
R80  5K  [R0805]
R81  Res3  value 10K  [R0603]
R82  5K  [R0805]
R83  5K  [R0805]
R84  1K  [R0805]
R85  Res3  value 10K  [R0603]
R86  47k  [R0805]
R87  15K  [R0805]
R88  15K  [R0805]
R89  12  value CMA02040X1209GB300  [MELF 0204]
R90  Res3  value 0  [R0603]
R91  12  value CMA02040X1209GB300  [MELF 0204]
R94  15K  [R0805]
R95  ResSMD  [R0805]  (value not drawn)
R96  Res3  value 0  [R0603]
R97  CMA02040X1209GB300  value 1  [MMF50S]
R98  10K  [R0805]
R99  10K  [R0805]
R100  10K  [R0805]
R101  10K  [R0805]
R102  10K  [R0805]
R103  10K  [R0805]
R104  10K  [R0805]
R105  10K  [R0805]
R106  Res3  value 0  [R0603]
R107  0  [R0805]
R108  Res1  value 1  [R0805]
R109  CMA02040X1209GB300  [MELF 0204]
R110  Res3  value 0  [R0603]
R111  Res3  value 0  [R0603]
R112  CMA02040X1209GB300  value 1  [MMF50S]
R113  5K  [R0805]
R114  Res3  value 10K  [R0603]
R115  5K  [R0805]
R116  5K  [R0805]
R117  1K  [R0805]
R118  Res3  value 10K  [R0603]
R119  15K  [R0805]
R120  47k  [R0805]
R121  1K  [R0805]
R122  1K  [R0805]
R123  Res3  value 0  [R0603]
R124  Res3  value 0  [R0603]
R125  MOVS2825V420  [MOVS2825V420]
R126  0  [R0603]
R127  15k  [R0603]
R129  4.7k  [R0805]
R130  4.7k  [R0805]
R131  100  [R0805]
R132  4.7k  [R0805]
R133  4.7k  [R0805]
R134  0  [R0805]
R135  0  [R0805]
R136  Res1  value 15k  [R0805]
R137  1K  [R0805]
R138  1K  [R0805]
R139  1K  [R0805]
R140  0 SMD  [R0805]
R141  0 SMD  [R0805]
R142  0 SMD  [R0805]
R143  ResSMD  [R0805]  (value not drawn)
R144  0 SMD  [R0805]
R145  0 SMD  [R0805]
R146  0 SMD  [R0805]
R147  ResSMD  [R0805]  (value not drawn)
R148  ResSMD  [R0805]  (value not drawn)
R149  ResSMD  [R0805]  (value not drawn)
R150  ResSMD  [R0805]  (value not drawn)
R151  ResSMD  [R0805]  (value not drawn)
R152  ResSMD  [R0805]
R153  ResSMD  [R0805]  (value not drawn)
R154  Res3  value 0  [R0603]
R155  ResSMD  [R0805]  (value not drawn)
R156  ResSMD  [R0805]  (value not drawn)
R157  ResSMD  [R0805]  (value not drawn)
R158  ResSMD  [R0805]  (value not drawn)
R159  ResSMD  [R0805]  (value not drawn)
R160  0 SMD  [R0805]
R161  ResSMD  [R0805]  (value not drawn)
R162  Res3  value 0  [R0603]
R163  Res3  value 0  [R0603]
R164  ResSMD  [R0805]  (value not drawn)
R165  ResSMD  [R0805]  (value not drawn)
R166  ResSMD  [R0805]  (value not drawn)
R167  0 SMD  [R0805]
R168  0 SMD  [R0805]
R169  ResSMD  [R0805]  (value not drawn)
R170  ResSMD  [R0805]  (value not drawn)
R171  0 SMD  [R0805]
R172  0 SMD  [R0805]
R173  ResSMD  [R0805]  (value not drawn)
R174  ResSMD  [R0805]  (value not drawn)
R175  ResSMD  [R0805]  (value not drawn)
T1  Full Transformer  [Full_Transformer]
TP1  Pad  [TP-0.5mm]
TP2  Pad  [TP-0.5mm]
TP3  Pad  [TP-0.5mm]
TP4  Pad  [TP-0.5mm]
TP5  Pad  [TP-0.5mm]
TP6  Pad  [TP-0.5mm]
TP7  Pad  [TP-0.5mm]
TP8  Pad  [TP-0.5mm]
TP9  Pad  [TP-0.5mm]
TP10  Pad  [TP-0.5mm]
TP11  Pad  [TP-0.5mm]
TP12  Pad  [TP-0.5mm]
TP13  Pad  [TP-0.5mm]
TP14  Pad  [TP-0.5mm]
TP15  Pad  [TP-0.5mm]
TP16  Pad  [TP-0.5mm]
TP17  Pad  [TP-0.5mm]
TP18  Pad  [TP-0.5mm]
TP19  Pad  [TP-0.5mm]
TP20  Pad  [TP-0.5mm]
TP21  Pad  [TP-0.5mm]
TP22  Pad  [TP-0.5mm]
TP23  Pad  [TP-0.5mm]
TP24  Pad  [TP-0.5mm]
TP25  Pad  [TP-0.5mm]
TP26  Pad  [TP-0.5mm]
TP27  Pad  [TP-0.5mm]
TP28  Pad  [TP-0.5mm]
TP29  Pad  [TP-0.5mm]
TP30  Pad  [TP-0.5mm]
TP31  Pad  [TP-0.5mm]
TP32  Pad  [TP-0.5mm]
TP33  Pad  [TP-0.5mm]
TP34  Pad  [TP-0.5mm]
TP35  Pad  [TP-0.5mm]
TP36  Pad  [TP-0.5mm]
TP37  Pad  [TP-0.5mm]
TP38  Pad  [TP-0.5mm]
TP39  Pad  [TP-0.5mm]
TP40  Pad  [TP-0.5mm]
TP41  Pad  [TP-0.5mm]
TP42  Pad  [TP-0.5mm]
TP43  Pad  [TP-0.5mm]
TP44  Pad  [TP-0.5mm]
TP45  Pad  [TP-0.5mm]
TP46  Pad  [TP-0.5mm]
TP47  Pad  [TP-0.5mm]
TP48  Pad  [TP-0.5mm]
TP49  Pad  [TP-0.5mm]
TP50  Pad  [TP-0.5mm]
TP51  Pad  [TP-0.5mm]
TP52  Pad  [TP-0.5mm]
TP53  Pad  [TP-0.5mm]
TP54  Pad  [TP-0.5mm]
TP55  Pad  [TP-0.5mm]
TP56  Pad  [TP-0.5mm]
TP57  Pad  [TP-0.5mm]
TP58  Pad  [TP-0.5mm]
TP59  Pad  [TP-0.5mm]
TP60  Pad  [TP-0.5mm]
TP61  Pad  [TP-0.5mm]
TP62  Pad  [TP-0.5mm]
TP63  Pad  [TP-0.5mm]
TP64  Pad  [TP-0.5mm]
TP65  Pad  [TP-0.5mm]
TP66  Pad  [TP-0.5mm]
TP67  Pad  [TP-0.5mm]
TP68  Pad  [TP-0.5mm]
TP69  Pad  [TP-0.5mm]
TP70  Pad  [TP-0.5mm]
TP71  Pad  [TP-0.5mm]
TP72  Pad  [TP-0.5mm]
TP73  Pad  [TP-0.5mm]
TP74  Pad  [TP-0.5mm]
TP75  Pad  [TP-0.5mm]
TP76  Pad  [TP-0.5mm]
TP77  Pad  [TP-0.5mm]
TP78  Pad  [TP-0.5mm]
TP79  Pad  [TP-0.5mm]
TP80  Pad  [TP-0.5mm]
TP81  Pad  [TP-0.5mm]
TP82  Pad  [TP-0.5mm]
TP83  Pad  [TP-0.5mm]
TP84  Pad  [TP-0.5mm]
TP85  Pad  [TP-0.5mm]
TP86  Pad  [TP-0.5mm]
TP87  Pad  [TP-0.5mm]
U1  MJWI10-24S12-MIN  [MJWI10-24S12]
U2  SN74LVC1G17DBVT SOT23  [SOT95P280X145-5N]
U3  PC81713NIP1B  [SOP-4L]
U4  SN74LVC1G17DBVT SOT23  [SOT95P280X145-5N]
U5  SI8261BBD-C-ISR  [SLAB-SDIP6_N]
U6  IXDN609SIATR  [IXDN609SIATR]
U7  SN74LVC1G17DBVT SOT23  [SOT95P280X145-5N]
U8  SI8261BBD-C-ISR  [SLAB-SDIP6_N]
U9  IXDN609SIATR  [IXDN609SIATR]
U10  SN74LVC1G17DBVT SOT23  [SOT95P280X145-5N]
U11  SI8261BBD-C-ISR  [SLAB-SDIP6_N]
U12  IXDN609SIATR  [IXDN609SIATR]
U13  SN74LVC1G17DBVT SOT23  [SOT95P280X145-5N]
U14  SI8261BBD-C-ISR  [SLAB-SDIP6_N]
U15  IXDN609SIATR  [IXDN609SIATR]
U16  LT1764AEQ-3.3  [LT1764AEQ33TRPBF]
U17  CAS 15-NP  [CAS 15-NP]
U19  TLV2781IDBVR  [DBV0005A_L]
U20  NCV8114ASN165T1G  [TSOP-5]
U21  OPA27GP  [P0008A]

## Blocks framed on the sheet
Full bridge switches: C11-C19 C21 C23 C24 C26-C32 C35 C39 C40 CR17 CR18 D5-D10 D13-D18 F1 F4 Q1-Q4 R31-R36 R38 R39 R42 R43 R52 R54 R57 R58 R65 R66 R125 TP31 TP33 TP68 TP70-TP73 TP75-TP85
Current sensor: R123 R124 TP32 U17
13A current: P3
Fan control: C1-C4 D1 D2 DS1 DS2 FB1 FB2 P1 R1-R6 R10 R14 R15 R24 TP1 TP2 U1-U3
1.65V regulator: C78 C79 R137-R139 TP86 TP87 U20
Drives: C5-C10 C20 C33 C34 C36-C38 C41-C46 C53 C57-C59 C65 C66 D3 D4 D11 D12 D19-D22 DS3-DS5 DS9 FB3-FB5 FB10 R7-R9 R11-R13 R16-R23 R25-R30 R37 R40 R41 R44-R51 R53 R55 R56 R59-R64 R67-R86 R89-R91 R95-R97 R106-R118 R120 TP3-TP24 TP27 TP28 U4-U15
Protection: CR1 CR2
Protection: CR3 CR4
Output Voltage Sensor: C80-C88 FB13 Q5 R140-R175 TP40-TP48 U21
Protection: CR5 CR6
Protection: CR7 CR8
Protection: CR9 CR10
Internal power supplies: C47-C52 C54-C56 C60-C64 C67-C69 DS6-DS8 DS10-DS12 FB11 J1 PS1-PS4 R87 R88 R94 R119 R121 R122 TP25 TP26 TP29 TP35 TP53-TP58 TP61 TP62 TP65 U16
Full bridge connection: FB6-FB9 J2 R98-R105 TP49-TP52 TP59 TP60 TP63 TP64 TP66 TP67
Protection: CR11 CR12
Protection: CR13 CR14
Protection: CR15 CR16

## Nets
1.65V: C79.2 R135.2 R146.1 TP86.1 U20.5(VOUT)
3: J2.12 TP66.1
4: J2.24 TP67.1
+3.3VD: C73.2 R2.2 R11.2 R44.2 R70.2 R95.2 R140.1 R150.2 R171.1 U19.5(V+)
+3.3VD2: C60.1 C64.2 DS10.1(A) R14.1 TP26.1 U16.4(OUT) U16.5(SENSE)
+5V_MICRO: C69.2 C71.2 C72.2 C78.2 DS12.1(A) FB11.1 J2.13 J2.25 R3.1 R12.1 R15.1 R45.1 R71.1 R96.1 R138.1 R144.1 R149.2 R172.2 TP25.1 TP63.1 U17.13(+5V) U20.1(VIN)
+12V_Digital IN: C2.1 C49.1 C52.1 C56.1 C68.1 J1.1 PS1.22(+VIN) PS1.23(+VIN) PS2.22(+VIN) PS2.23(+VIN) PS3.22(+VIN) PS3.23(+VIN) PS4.22(+VIN) PS4.23(+VIN) TP55.1 U1.1(+In)
AC Output: F2.2 P2.1 P2.2 R141.1 TP69.1
E FB TEMP: J2.8
Fan: C3.1 C4.2 D1.1(A) DS1.1(A) P1.1 U1.3(+Out)
Fan FB command: FB1.1 J2.23
FB TEMP of the heatsink: FB2.2 J2.16
Gate 1: D8.2(C) Q1.1(G) R7.2 R9.2 R19.2 R33.2 TP71.1
Gate 2: D15.2(C) Q2.1(G) R37.2 R41.2 R50.2 R57.2 TP79.1
Gate 3: D16.2(C) Q3.1(G) R58.2 R67.2 R69.2 R76.2 TP80.1
Gate 4: D10.2(C) Q4.1(G) R34.2 R89.2 R91.2 R109.2 TP73.1
GND side FB: C21.1 C24.1 C26.2 C27.2 C28.2 C29.2 C30.2 C31.2 C32.1 C35.1 C37.2 C38.2 C39.1 C40.1 C45.2 C46.2 CR7.1(A) CR11.1(A) CR17.1(A) D13.1(A) D14.1(A) D15.1(A) D16.1(A) D17.1(A) D18.1(A) P3.3 P3.4 Q2.3(E) Q3.3(E) R40.1 R42.2 R43.2 R51.1 R57.1 R58.1 R64.1 R65.2 R66.2 R68.1 R77.1 R86.1 R125.1 R167.2 R168.2 TP33.1 TP83.1 TP84.1 TP85.1 U9.4(GND) U9.5(GND) U12.4(GND) U12.5(GND)  [also labelled GND_High voltage-input, Source 2, Source 3]
GND_DIGITAL: C1.2 C5.2 C20.2 C41.2 C53.2 C60.2 C62.1 C63.1 C64.1 C69.1 C71.1 C72.1 C73.1 C75.1 C77.1 C78.1 C79.1 C80.2 C82.2 C83.2 C86.2 J2.1 J2.14 Q5.5(GND2) R6.1 R10.2 R21.1 R23.2 R24.2 R25.1 R26.2 R27.2 R28.2 R29.1 R53.1 R56.2 R59.1 R60.2 R61.2 R62.2 R63.1 R78.1 R80.2 R81.1 R82.2 R83.2 R84.2 R85.1 R98.2 R99.2 R100.2 R101.2 R102.2 R103.2 R104.2 R105.2 R111.1 R113.2 R114.1 R115.2 R116.2 R117.2 R118.1 R121.2 R122.2 R124.1 R129.1 R134.2 R136.1 R137.2 R139.2 R143.2 R145.1 R160.2 R164.2 R175.2 TP8.1 TP14.1 TP20.1 TP28.1 TP29.1 TP32.1 TP38.1 TP39.1 TP48.1 TP64.1 TP87.1 U2.3(GND) U3.2(K) U4.3(GND) U5.3(CATHODE) U7.3(GND) U8.3(CATHODE) U10.3(GND) U11.3(CATHODE) U13.3(GND) U14.3(CATHODE) U16.3(GND) U16.6(TAB) U17.12(0V) U20.2(GND)
GND_Fan: C3.2 C4.1 D2.1(A) P1.2 R1.2 TP2.1 U1.5(-Out)
GND_GS1: C6.2 C7.2 C8.1 C19.2 C47.2 C48.1 CR2.1(A) PS1.16(-VOUT) R8.2 R20.2 R35.1 R87.2 TP6.1 TP53.1 U5.4(GND)
GND_GS2: C33.2 C34.2 C36.1 C39.2 C50.2 C51.1 CR6.1(A) PS2.16(-VOUT) R40.2 R51.2 R65.1 R88.2 TP12.1 TP56.1 U8.4(GND)
GND_GS3: C40.2 C42.2 C43.2 C44.1 C54.1 C55.2 CR10.1(A) PS3.16(-VOUT) R66.1 R68.2 R77.2 R94.2 TP18.1 TP61.1 U11.4(GND)
GND_GS4: C23.2 C57.2 C58.2 C59.1 C61.2 C67.1 CR14.1(A) PS4.16(-VOUT) R36.1 R90.2 R110.2 R119.2 TP24.1 TP65.1 U14.4(GND)
GND_High voltage-out: L1.2 P2.3 P2.4 R151.1 R152.1 R154.2 R162.1 R163.1 TP42.1 TP74.1
GND_IN: C2.2 C49.2 C52.2 C56.2 C68.2 J1.2 PS1.2(-VIN) PS1.3(-VIN) PS2.2(-VIN) PS2.3(-VIN) PS3.2(-VIN) PS3.3(-VIN) PS4.2(-VIN) PS4.3(-VIN) TP57.1 U1.2(-In) U3.3(E)
High side FB: C24.2 D5.2(C) D6.2(C) F1.2 Q1.2(C) Q4.2(C) R31.2 R32.2 R142.1 TP68.1
Input 400V: F4.1 P3.1 P3.2 R125.2 TP31.1
Input voltage of FB: J2.15 TP59.1
M1 FB command: FB3.1 FB9.2 R26.1 R105.1 TP3.1 TP49.1
M2 FB command: FB4.1 FB8.2 R60.1 R104.1 TP9.1 TP50.1
M3 FB command: FB5.1 FB7.2 R82.1 R103.1 TP15.1 TP51.1
M4 FB command: FB6.2 FB10.1 R102.1 R115.1 TP21.1 TP52.1
Output Current of FB to micro controller: FB12.2 J2.2
Output voltage of FB: FB13.2 J2.3 TP47.1 TP60.1
P1 OP37-2: R155.2 U21.1(OFFSET_TRIM)
P2 OP37-2: C87.1 R158.1 R159.2 R169.2 R170.2 U21.2(IN-)
P3 OP37-2: C86.1 R157.1 R164.1 U21.3(IN+)
P4 OP37-2: R145.2 R146.2 U21.4(VCC-)
P5 OP37-2: R143.1 U21.5(NC)
P6 OP37-2: C87.2 C88.1 R169.1 R170.1 R173.1 TP45.1 U21.6(OUT)
P7 OP37-2: C80.1 R140.2 R144.2 U21.7(VCC+)
P8 OP37-2: R165.2 U21.8(OFFSET_TRIM)
Relay FB command: J2.11
Source 1: C9.2 C10.2 C14.1 C15.2 C16.2 C18.2 C19.1 CR3.1(A) D6.1(A) D7.1(A) D8.1(A) D13.2(C) Q1.3(E) Q2.2(C) R8.1 R20.1 R30.1 R33.1 R35.2 R52.2 TP77.1 TP78.1 U6.4(GND) U6.5(GND) U17.1(IN) U17.2(IN) U17.3(IN)
Source 4: C11.2 C12.2 C13.2 C17.1 C23.1 C65.2 C66.2 CR15.1(A) D5.1(A) D9.1(A) D10.1(A) D14.2(C) L1.1 Q3.2(C) Q4.3(E) R34.1 R36.2 R54.2 R90.1 R110.1 R120.1 TP75.1 TP76.1 U15.4(GND) U15.5(GND)
Spare Analog FB 1: J2.4
Spare Analog FB 2: J2.17
Spare Analog FB 3: J2.5
Spare Analog FB 4: J2.18
Spare Dig FB 1: J2.20
Spare Dig FB 2: J2.7
Spare Dig FB 3: J2.19
Spare Dig FB 4: J2.6
VDD Sensor voltage out: C85.1 Q5.1(VDD1)
VGS 1: C6.1 C7.1 C8.2 C9.1 C10.1 C14.2 C47.1 C48.2 CR1.2(K) CR4.2(K) D7.2(K) DS6.1(A) PS1.14(+VOUT) TP35.1 TP70.1 U5.6(VDD) U6.1(VCC) U6.8(VCC)
VGS 2: C32.2 C33.1 C34.1 C36.2 C37.1 C38.1 C50.1 C51.2 CR5.2(K) CR8.2(K) D17.2(K) DS7.1(A) PS2.14(+VOUT) TP54.1 TP81.1 U8.6(VDD) U9.1(VCC) U9.8(VCC)
VGS 3: C35.2 C42.1 C43.1 C44.2 C45.1 C46.1 C54.2 C55.1 CR9.2(K) CR12.2(K) D18.2(K) DS8.1(A) PS3.14(+VOUT) TP58.1 TP82.1 U11.6(VDD) U12.1(VCC) U12.8(VCC)
VGS 4: C17.2 C57.1 C58.1 C59.2 C61.1 C65.1 C66.1 C67.2 CR13.2(K) CR16.2(K) D9.2(K) DS11.1(A) PS4.14(+VOUT) TP62.1 TP72.1 U14.6(VDD) U15.1(VCC) U15.8(VCC)
NetC1_1: C1.1 R2.1 R3.2 U2.5(VCC)
NetC5_1: C5.1 R11.1 R12.2 U4.5(VCC)
NetC11_1: C11.1 C12.1 C13.1 R31.1
NetC15_1: C15.1 C16.1 C18.1 R32.1
NetC20_1: C20.1 R44.1 R45.2 U7.5(VCC)
NetC21_2: C21.2 CR18.1(A) F1.1 F4.2 R38.1 R39.1
NetC22_1: C22.1 C25.1 F2.1
NetC22_2: C22.2 C25.2 F3.2
NetC26_1: C26.1 C27.1 C28.1 R52.1
NetC29_1: C29.1 C30.1 C31.1 R54.1
NetC41_1: C41.1 R70.1 R71.2 U10.5(VCC)
NetC53_1: C53.1 R95.1 R96.2 U13.5(VCC)
NetC62_2: C62.2 C63.2 FB11.2 U16.1(~{SHDN}) U16.2(IN)
NetC70_1: C70.1 R127.2 R131.1 U19.1(OUT)
NetC70_2: C70.2 R126.1 R130.2 TP34.1 U19.4(IN-)
NetC74_1: C74.1 R132.2 R133.1
NetC74_2: C74.2 R129.2 R130.1
NetC75_2: C75.2 FB12.1 R131.2 TP36.1
NetC77_2: C77.2 R133.2 R136.2 TP37.1 U19.3(IN+)
NetC81_1: C81.1 Q5.6(VOUT-) R158.2 R159.1 TP44.1
NetC81_2: C81.2 R153.2
NetC82_1: C82.1 C83.1 Q5.8(VDD2) R149.1 R150.1
NetC84_1: C84.1 Q5.2(VIN) R147.1 R148.1 R151.2 R152.2 TP41.1
NetC84_2: C84.2 C85.2 Q5.4(GND1) R154.1 R162.2 R168.1 TP46.1
NetC88_2: C88.2 R173.2 R174.1
NetCR1_1: CR1.1(A) CR2.2(K) R18.1 R30.2 TP5.1 U5.5(VO)
NetCR3_2: CR3.2(K) CR4.1(A) D3.2(C) D4.2(C) R13.1 R22.1 TP7.1 U6.6(OUT) U6.7(OUT)
NetCR5_1: CR5.1(A) CR6.2(K) R49.1 R64.2 TP11.1 U8.5(VO)
NetCR7_2: CR7.2(K) CR8.1(A) D11.2(C) D12.2(C) R46.1 R55.1 TP13.1 U9.6(OUT) U9.7(OUT)
NetCR9_1: CR9.1(A) CR10.2(K) R75.1 R86.2 TP17.1 U11.5(VO)
NetCR11_2: CR11.2(K) CR12.1(A) D19.2(C) D20.2(C) R72.1 R79.1 TP19.1 U12.6(OUT) U12.7(OUT)
NetCR13_1: CR13.1(A) CR14.2(K) R108.1 R120.2 TP23.1 U14.5(VO)
NetCR15_2: CR15.2(K) CR16.1(A) D21.2(C) D22.2(C) R97.1 R112.1 TP27.1 U15.6(OUT) U15.7(OUT)
NetCR17_2: CR17.2(K) CR18.2(K)
NetD1_2: D1.2(K) D2.2(K)
NetD3_1: D3.1(A) D4.1(A) R7.1 R9.1
NetD11_1: D11.1(A) D12.1(A) R37.1 R41.1
NetD19_1: D19.1(A) D20.1(A) R67.1 R69.1
NetD21_1: D21.1(A) D22.1(A) R89.1 R91.1
NetDS1_2: DS1.2(K) R1.1
NetDS2_1: DS2.1(A) R5.1 TP1.1 U2.4(Y)
NetDS2_2: DS2.2(K) R10.1
NetDS3_1: DS3.1(A) R17.1 TP4.1 U4.4(Y)
NetDS3_2: DS3.2(K) R28.1
NetDS4_1: DS4.1(A) R48.1 TP10.1 U7.4(Y)
NetDS4_2: DS4.2(K) R62.1
NetDS5_1: DS5.1(A) R74.1 TP16.1 U10.4(Y)
NetDS5_2: DS5.2(K) R84.1
NetDS6_2: DS6.2(K) R87.1
NetDS7_2: DS7.2(K) R88.1
NetDS8_2: DS8.2(K) R94.1
NetDS9_1: DS9.1(A) R107.1 TP22.1 U13.4(Y)
NetDS9_2: DS9.2(K) R117.1
NetDS10_2: DS10.2(K) R121.1
NetDS11_2: DS11.2(K) R119.1
NetDS12_2: DS12.2(K) R122.1
NetF3_1: F3.1 U17.8(OUT) U17.9(OUT) U17.10(OUT)
NetFB1_2: FB1.2 R4.1
NetFB2_1: FB2.1 P1.4 R24.1
NetFB3_2: FB3.2 R16.1 R27.1
NetFB4_2: FB4.2 R47.1 R61.1
NetFB5_2: FB5.2 R73.1 R83.1
NetFB6_1: FB6.1 J2.21 R98.1
NetFB7_1: FB7.1 J2.9 R99.1
NetFB8_1: FB8.1 J2.22 R100.1
NetFB9_1: FB9.1 J2.10 R101.1
NetFB10_2: FB10.2 R106.1 R116.1
NetFB13_1: FB13.1 R174.2 R175.1
NetP1_3: P1.3 R14.2 R15.2
NetQ5_3: Q5.3(SHDN) R163.2 R167.1
NetQ5_7: Q5.7(VOUT+) R153.1 R157.2 TP43.1
NetR4_2: R4.2 U2.2(A)
NetR5_2: R5.2 U3.1(A)
NetR6_2: R6.2 U2.1(NC)
NetR13_2: R13.2 R19.1 R22.2
NetR16_2: R16.2 U4.2(A)
NetR17_2: R17.2 R23.1 U5.1(ANODE)
NetR18_2: R18.2 U6.2(IN)
NetR21_2: R21.2 U4.1(NC)
NetR25_2: R25.2 U5.2(NC)
NetR29_2: R29.2 U6.3(NC)
NetR38_2: R38.2 R42.1
NetR39_2: R39.2 R43.1
NetR46_2: R46.2 R50.1 R55.2
NetR47_2: R47.2 U7.2(A)
NetR48_2: R48.2 R56.1 U8.1(ANODE)
NetR49_2: R49.2 U9.2(IN)
NetR53_2: R53.2 U7.1(NC)
NetR59_2: R59.2 U8.2(NC)
NetR63_2: R63.2 U9.3(NC)
NetR72_2: R72.2 R76.1 R79.2
NetR73_2: R73.2 U10.2(A)
NetR74_2: R74.2 R80.1 U11.1(ANODE)
NetR75_2: R75.2 U12.2(IN)
NetR78_2: R78.2 U10.1(NC)
NetR81_2: R81.2 U11.2(NC)
NetR85_2: R85.2 U12.3(NC)
NetR97_2: R97.2 R109.1 R112.2
NetR106_2: R106.2 U13.2(A)
NetR107_2: R107.2 R113.1 U14.1(ANODE)
NetR108_2: R108.2 U15.2(IN)
NetR111_2: R111.2 U13.1(NC)
NetR114_2: R114.2 U14.2(NC)
NetR118_2: R118.2 U15.3(NC)
NetR123_1: R123.1 R124.2 R132.1 TP30.1
NetR123_2: R123.2 U17.11(OUT)
NetR126_2: R126.2 R127.1
NetR134_1: R134.1 R135.1 U19.2(V-)
NetR137_1: R137.1 U20.4(NC)
NetR138_2: R138.2 R139.1 U20.3(CE)
NetR141_2: R141.2 R142.2 R147.2 R148.2 TP40.1
NetR155_1: R155.1 R156.2
NetR156_1: R156.1 R160.1 R161.1
NetR161_2: R161.2 R166.1 R171.2 R172.1
NetR165_1: R165.1 R166.2
NetU1_6: U1.6(on/off) U3.4(C)

Not connected (* = marked no-connect by the designer): J2 M1 M2; PS1 9(NC) 11(NC1); PS2 9(NC) 11(NC1); PS3 9(NC) 11(NC1); PS4 9(NC) 11(NC1); U1 4(trim)

## Notes on the sheet
- 3700W 400V Full Bridge converter
- Note: The part number and the scheme are not the same.
- (near F3) 0031.8002 16A fuse
- (near L1) EPCOS ETD39 N87
- To processor
- Fuse part number: KLKD008.T 8A fuse
- 100k, 6.8mm*18mm Resistors
- Resounance section
- 694-100 is the heat sink part number
- r129 footprint is not correct
- Current sensor
- Footprint of R19?
  What is Axial 0.3 inches resistor
- CMA02040X1209GB300
- Not axial, (1.4mm*3.6mm)
- (near R7) Not axial
- Fast Driving circuit
- NTCLE413 NTC thermistor
- Optocoupler
- (near R20) 0603 Resistor
- Checking the part number with size (package)
- (near R22) Axial 0.3 inches resistor
- From processor
- (near R51) 0603 Resistor
- (near R55) Axial 0.3 inches resistor
- MB is Mosfet of Buck
- (near R77) 0603 Resistor
- (near R79) Axial 0.3 inches resistor
- Input cap
- (near R110) 0603 Resistor
- (near R112) Axial 0.3 inches resistor
- (in symbol Full_Transformer) Full bridge Heatsink

## Library data of the parts
C1-C3 C5-C7 C9 C10 C20 C33 C34 C37 C38 C41-C43 C45-C47 C49 C50 C52 C53 C55-C58 C60 C61 C65 C66 C68 C80 C82 = Cap Pol2: Polarized Capacitor (Axial); Published: 8-Jun-2000; LatestRevisionDate: 17-Jul-2002; LatestRevisionNote: Re-released for DXP Platform.; PackageReference: POLAR0.8; Publisher: Altium Limited
C4 C48 C51 C54 C63 C64 C67 C70-C75 C77 C78 = Cap: Capacitor; Published: 8-Jun-2000; LatestRevisionDate: 17-Jul-2002; LatestRevisionNote: Re-released for DXP Platform.; PackageReference: RAD-0.3; Publisher: Altium Limited
C8 C14 C17 C19 C21-C25 C32 C35 C36 C39 C40 C44 C59 C69 C81 C86 = CapSMD
C11-C13 C15 C16 C18 C26-C31 = Ceramic disk capacitor: MF: AVX; MP: LD052C153JAB2A; Price: None; SnapEDA_Link: https://www.snapeda.com/parts/LD052C153JAB2A/AVX/view-part/2034833/?ref=snap; Package: 0805 AVX; Availability: Warning; Value: *
C62 = Cap ceramic: None polar capacitor; Value: 100nF
C79 = CMP-08246-005389-1: Multilayer Ceramic Capacitors 1μF ±10% 25V X5R SMD 0805; Capacitance: 1uF; Min Operating Temperature: -55°C; Construction: Flat; Package Quantity: 2000; Height: 1.25mm; Resistor Type: Ceramic; Case/Package: 0805; Depth: 1.25mm; Case Code (Metric): 2012; Weight: 0.000194oz; REACH SVHC: No SVHC; Dielectric: X5R; Max Operating Temperature: 85°C; Number of Pins: 2; Thickness: 0.057inch; RoHS Compliant: Yes; Radiation Hardening: No; Lead Free: Lead Free; Case Code (Imperial): 0805; Length: 2mm; Voltage Rating: 25V; Mount: Surface Mount; Voltage Rating (DC): 25V; Packaging: Tape and Reel; Dielectric Material: Ceramic; Termination: SMD/SMT; Voltage: 25V; Tolerance: 10%; Series: C; Width: 0.049inch
C83-C85 C87 C88 = Cap ceramic: None polar capacitor; Volte: 50v
  C83 C85 C88: Value: 100nF
  C84 C87: Value: 100pF
CR1-CR18 = DiodeSMD4.5mm
D1 D7 D9 D17 D18 = D Zener: Zener Diode; Published: 8-Jun-2000; LatestRevisionDate: 17-Jul-2002; LatestRevisionNote: Re-released for DXP Platform.; PackageReference: DIODE-0.7; Publisher: Altium Limited; PackageDescription: Diode, Thru-Hole; 2 Leads; 0.7 in Pin Spacing
D2 = D Schottky: Schottky Diode; Published: 8-Jun-2000; LatestRevisionDate: 17-Jul-2002; LatestRevisionNote: Re-released for DXP Platform.; PackageReference: SMB; Publisher: Altium Limited; PackageDescription: DO-214-AA/SMB; 2 C-Bend Leads; Body 5.3 x 3.6 mm, inc. leads (LxW); Code_JEDEC: DO-214-AA
D3-D6 D8 D10-D16 D19-D22 = 1N4007: Diode Standard 1000V 1A Through Hole DO-204AL _DO-41_; MF: ON Semiconductor; Package: DO-41 Good-Ark; Value: *; Price: None; MP: 1N4007; Availability: Unavailable; SnapEDA_Link: https://www.snapeda.com/parts/1N4007/ON%20Semiconductor/view-part/2816213/?ref=snap
DS2-DS5 DS9 DS12 = LED: Blue SURFACE MOUNT LED LAMP, -40 to +85 ,0805 SIZE; PART NUMBER: QTLP630C-7; MANUFACTURE: Fairchild Semiconductor
F1-F4 = Fuse 1: Fuse; Published: 8-Jun-2000; LatestRevisionDate: 17-Jul-2002; LatestRevisionNote: Re-released for DXP Platform.; PackageReference: PIN-W2/E2.8; Publisher: Altium Limited; PackageDescription: Thru-Hole; 2 Leads
FB2 FB12 FB13 = FERRITE CHIP
HS1 HS2 = Full_bridge_Heatsink
J1 = 691101710002: WR-TBL Series 101 Horizontal Entry Modular, THT, pitch 5mm, 2p; Manufacturer: Wurth Elektronik; Modularity: Yes; Rated Current: 16A; Working Voltage: 250V; ComponentLink1Description: Website Link; ComponentLink1URL: https://www.we-online.com/redexpert/article/691101710002?ad; ComponentLink2Description: Datasheet Link; ComponentLink2URL: https://www.we-online.com/redexpert/spec/691101710002?ad; Manufacturer Part Number: 691101710002; Category: Terminal Blocks; Match Code: WR-TBL; Mount: Through Hole; Operating Temperature Max: 105°C; Operating Temperature Min: -40°C; Packaging: Box; Application: Pressure Clamp; Number of Pins: 2; Number of Rows: 1; Orientation: Horizontal; Pitch: 5mm
J2 = CMP-1502-00282-1: Male PCB Connector with Hex Screw WR-DSUB, Vertical, 25 pins; Manufacturer: Wurth Elektronik; Working Voltage: 125VAC; Contact Resistance: 30mOhm; Rated Current: 3A; Pin Number: 25; Publisher: WurthElektronik; Gender: Male; Orientation: Vertical; Operating Temperature: -40to85degC; Datasheet URL: https://katalog.we-online.de/em/datasheet/6180xx29221.pdf; Package Reference: 61802529221; Packaging: Tray; Mounting Technology: THT; Part Number: 61802529221; Manufacturer URL: http://www.we-online.de
L1 = Inductor: Code_IEC: 1005; Published: 8-Jun-2000; LatestRevisionDate: 29-May-2009; LatestRevisionNote: IPC-7351 Footprint Added.; PackageReference: 0402-A; Publisher: Altium Limited; PackageDescription: Chip Inductor; Code_JEITA: 0402
P1 = CMP-2000-05548-1: Male Header, Pitch 2.54 mm, 1 x 4 Position, Height 12.8 mm, Tail Length 3.5 mm, -55 to 105 degC, RoHS, Bulk; Manufacturer: TE Connectivity; Pitch: 0.100"(2.54mm); Connector Type: Header,Shrouded; Other Names: 280371-2-ND / A106401; Number of Positions Loaded: All; Dynamic Catalog: AMPMODUModIISeries; Number of Positions: 4; 3D Model: 280371-2.pdf; Termination: Solder; Package Description: Male Header, Pitch 2.54 mm, 1 x 4 Position, Height 12.8 mm, Tail Length 3.5 mm; Datasheet Version: Rev. M1, 08/2016; Contact Mating Length: 0.260"(6.60mm); Datasheet URL: http://www.te.com/commerce/DocumentDelivery/DDEController?Action=showdoc&DocId=Customer+Drawing%7F280370%7FM1%7Fpdf%7FEnglish%7FENG_CD_280370_M1.pdf%7F280371-2; Mounting Technology: ThroughHole; Standard Package: 1,000; Contact Finish Thickness: 15µin(0.38µm); Contact Finish: Gold; Contact Type: MalePin; Packaging: Bulk; Mounting Type: ThroughHole; Number of Rows: 1; Family: RectangularConnectors-Headers,MalePins; Manufacturer URL: http://www.te.com/; Color: Black; RoHS Information: 280371-2StatementofCompliance; Package Reference: 280371-2; Category: Connectors,Interconnects; Series: AMPMODUModII
P2 P3 = CMP-1502-02410-1: Serie 3114 - 7.62mm Close Vertical PCB Header WR-TBL, 4 pin; Manufacturer: Wurth Elektronik; Gender: Male; Pin Number: 4; Packaging: Box; Datasheet URL: http://katalog.we-online.de/em/datasheet/6913114001xx.pdf; Operating Temperature: -40to105degC; Package Reference: 691311400104; Mounting Technology: THT; Publisher: WurthElektronik; Pitch: 7.62mm; Manufacturer URL: http://www.we-online.de; Part Number: 691311400104
PS1-PS4 = REC5-2415SRWZ/H6/A: DC/DC-Converter, 2kV, 4kVDC & 6kVDC Isolation. Continuous Short Circuit Protection; Package: None; Price: None; Value: *; MP: REC5-2415SRWZ/H6/A; Availability: Unavailable
Q1-Q4 = CMP-1166-00078-1: 1200 V IGBT in Trench and Fieldstop Technology with Soft, Fast Recovery Anti-Parallel Diode, 80 A IC, -40 to 175 degC, PG-TO247-3-44, Tube, Green; Manufacturer: Infineon; PartNumber: IKW40N120H3; Green: TRUE; IF (max): 40 A; Eoff (typ): 1.2Â mJ; VCE(sat) (typ): 2.05Â V; VF (typ): 2.4 V; QGate (typ): 185 nC; Switching Frequency: HighSpeed3 20-100kHz; tf (typ): 16Â ns; ICpuls (max): 160 A; Eon (typ): 3.2 mJ; IC(max) @ 100degrees: 40Â A; tr (typ): 57 ns; td(off) (typ): 290 ns; IC(max) @ 25degrees: 80Â A; Qrr (typ): 1.9 uC; VCE (max): 1,200Â V; td(on) (typ): 30 ns; Irrm (typ): 12.8 A; DatasheetVersion: Rev. 1.2; ComponentLink1Description: Manufacturer URL; PackageDescription: 3-Pin Plastic (Green) Transistor Single Outline Package, 15.94 x 20.95 mm Body, 5.44 mm Pitch; ComponentLink2URL: http://www.infineon.com/dgdl/IKW40N120H3_Rev1_2G.pdf?folderId=db3a30431c69a49d011c6f86019b00a1&fileId=db3a304325305e6d012591d4832f7032; ComponentLink2Description: Datasheet; ComponentLink3URL: http://www.infineon.com/cms/packages/Leaded_and_through-hole/P-PG-TO247/P-PG-TO247-3-44.html?__locale=en; ComponentLink1URL: http://www.infineon.com/; ComponentLink3Description: Package Specification; IFpuls (max): 160 A; Packing: Tube; Mounting Technology: Through Hole; PackageReference: PG-TO247-3-44; PackageVersion: Rev. 03; Halogen-free: available
Q5 = CMP-18360-000002-1: IC OPAMP ISOLATION 100KHZ 8SO; Turn-On Delay Time: 6500ns; Number of Circuits: 1; Forward Current: 230mA; Max Supply Voltage: 5.5V; Min Supply Voltage: 4.5V; Operating Supply Voltage: 5V; Operating Supply Current: 10.5mA; Input Offset Voltage (Vos): 300uV; Input Bias Current: 1.5nA; Nominal Supply Current: 15mA; Isolation Voltage: 5kV; Output Current per Channel: 30mA; -3db Bandwidth: 100kHz; Radiation Hardening: No; Case/Package: SOIC; Min Operating Temperature: -40°C; Number of Pins: 8; Package Quantity: 1000; Bandwidth: 100kHz; Propagation Delay: 6500ns; Packaging: Tape and Reel; Number of Channels: 1; Max Operating Temperature: 105°C; Mount: Surface Mount
R1 R5 R10 R17 R23 R26-R28 R33 R34 R48 R56-R58 R60-R62 R74 R80 R82-R84 R87 R88 R94 R98-R105 R107 R113 R115-R117 R119 R122 R131 R134 R135 R137-R142 R144-R146 R160 R167 R168 R171 R172 = ResSMD
R3 R4 R6 R8 R12 R16 R20 R21 R25 R29 R40 R45 R47 R51 R53 R59 R63 R68 R71 R73 R77 R78 R81 R85 R90 R96 R106 R110 R111 R114 R118 R123 R124 R154 R162 R163 = Res3: Resistor; Published: 8-Jun-2000; LatestRevisionDate: 29-May-2009; LatestRevisionNote: IPC-7351 Footprint Added.; PackageReference: J1-0603; Publisher: Altium Limited; PackageDescription: Chip Resistor
R7 R9 R31 R32 R37-R39 R41-R43 R52 R54 R67 R69 R89 R91 = Res Semi: Semiconductor Resistor; Published: 8-Jun-2000; LatestRevisionDate: 17-Jul-2002; LatestRevisionNote: Re-released for DXP Platform.; PackageReference: AXIAL-0.5; Publisher: Altium Limited; PackageDescription: Axial Device, Thru-Hole; 2 Leads; 0.5 in Pin Spacing
R13 R18 R22 R30 R35 R36 R46 R49 R55 R64-R66 R72 R75 R79 R86 R97 R108 R112 R120 R136 = Res1: Resistor; Published: 8-Jun-2000; LatestRevisionDate: 17-Jul-2002; LatestRevisionNote: Re-released for DXP Platform.; PackageReference: AXIAL-0.3; Publisher: Altium Limited; PackageDescription: Axial Device, Thru-Hole; 2 Leads; 0.3 in Pin Spacing
  R30 R64 R86 R120: Value: 47k
R19 R50 R76 R109 = Res1: Resistor; Value: 1; Published: 8-Jun-2000; LatestRevisionDate: 17-Jul-2002; LatestRevisionNote: Re-released for DXP Platform.; PackageReference: AXIAL-0.3; Publisher: Altium Limited; PackageDescription: Axial Device, Thru-Hole; 2 Leads; 0.3 in Pin Spacing
R121 = Res: resistor 1/4 wat; Value: 1K
R125 = Res Varistor: Varistor (Voltage-Sensitive Resistor); Published: 24-Mar-1999; LatestRevisionDate: 29-May-2009; LatestRevisionNote: IPC-7351 Footprint Added.; PackageVersion: Mar-2003; PackageReference: 6-0805; Publisher: Altium Limited; PackageDescription: Chip Resistor 0805 Case Size; Code_IPC: RESC2012
R126 R127 R129 R130 R132 R133 = CMP-1014-00542-3: RES Thick Film, 2kΩ, 1%, 0.25W, 100ppm/°C, 1206; Max Power Dissipation: 250mW; Voltage Rating: 200V; Resistance: 2kR; Package Quantity: 10; Height: 0.55mm; Tolerance: 1%; Number of Terminations: 2; Mount: Surface Mount; Width: 1.6mm; Length: 3.2mm; Features: Automotive AEC-Q200; Contact Plating: Tin; Number of Pins: 2; Weight: 0.000353oz; Max Operating Temperature: 155°C; Min Operating Temperature: -55°C; Termination: SMD/SMT; Temperature Coefficient: 100ppm/°C; Case Code (Imperial): 1206; Depth: 1.6mm; Military Standard: Not; Case Code (Metric): 3216; Composition: Thick Film; Power Rating: 250mW; Case/Package: 1206; Radiation Hardening: No; Packaging: Tape and Reel
T1 = Full_Transformer
TP1-TP87 = Con1 pin-Small
U1 = MINMAX-MJWI20
U2 U4 U7 U10 U13 = CMP-0859-00388-5: IC BUF NON-INVERT 5.5V SC70-5; Number of Elements: 1; Polarity: Non-Inverting; Low Level Output Current: 32mA; Propagation Delay: 11ns; Logic Function: Schmitt Trigger; Min Supply Voltage: 1.65V; Quiescent Current: 1.5uA; High Level Output Current: -32mA; Packaging: Tape and Reel; Number of Gates: 1; Number of Output Lines: 1; Package Quantity: 1; Radiation Hardening: No; Max Supply Voltage: 5.5V; Contact Plating: Gold; Number of Outputs: 1; Number of Channels: 1; Termination: SMD/SMT; REACH SVHC: No SVHC; Number of Inputs: 1; Turn-On Delay Time: 11ns; Min Operating Temperature: -40°C; Number of Bits: 1; Number of Input Lines: 1; Number of Bits per Element: 1; Case/Package: SC; Number of Pins: 5; Mount: Surface Mount; Lead Free: Lead Free; Max Operating Temperature: 125°C
U3 = PC817
U5 U8 U11 U14 = CMP-0512-00083-1: Led Emulator Input, 4.0 A Isolated Gate Drivers, 5 to 30 V Driver Supply, 5 kVRMS Isolation Rating, -40 to 125 degC, 6-pin SOP; Manufacturer: Silicon Labs; Overlap Protection & Dead Time Control: FALSE; Max. Prop. Delay (ns): 60; Sub-Family: ISOdrivers; Isolation Rating (Input-Output, kVrms): 5; UVLO Voltage: 8 V; 10kV surge: TRUE; Driver Supply: 5 to 30 V; ComponentLink2URL: http://www.silabs.com/Support%20Documents/TechnicalDocs/Si826x.pdf; PackageDescription: 6-Pin SDIP, Body 4.58 x 7.5 mm, Pitch 1.27 mm; ComponentLink3Description: Package Specification; Mounting Technology: Surface Mount; DatasheetVersion: Rev. 0.9; PartNumber: Si8261BBD-C-IS; ComponentLink2Description: Datasheet; ComponentLink1URL: http://www.silabs.com/; PackageReference: SDIP6; ComponentLink1Description: Manufacturer URL; ComponentLink3URL: http://www.silabs.com/Support%20Documents/TechnicalDocs/Si826x.pdf
U6 U9 U12 U15 = CMP-1550-00001-1: 9-Ampere Low-Side Ultrafast MOSFET Driver, 4.5 to 35 V, 200 KOhm, -40 to 125 degC, 8-Pin SOIC (SI), RoHS, Tube; Number of Configurations: 1; VCC Max: 35 V; VCC Min: 4.5 V; ComponentLink1Description: Manufacturer URL; Temperature Max: 125 degC; Packing: Tube; RoHS: TRUE; REN Typ: 200 kOhm; ComponentLink2URL: http://www.ixysic.com/home/pdfs.nsf/www/IXD_609.pdf/$file/IXD_609.pdf; ComponentLink3Description: Package Specification; Number of Outputs: 1; ComponentLink1URL: http://www.ixys.com/; ComponentLink2Description: Datasheet; PackageDescription: 8-Pin Small Outline Integrated Circuit Package, Body 4.928 x 3.937 mm, Pitch 1.27 mm; Mounting Technology: Surface Mount; PartNumber: IXDN609SI; Temperature Min: -40 degC; ComponentLink3URL: http://www.ixysic.com/home/pdfs.nsf/www/IXD_609.pdf/$file/IXD_609.pdf
U16 = LT1764AEQ-3.3: 3 A, Fast Transient Response, Low Noise, LDO Regulator, 2.7 to 20 V Vin, 3.3 V Vout, 5-pin DPAK (Q-5), -40 to 125 degC; Manufacturer: Linear Technology; Discrete Pass Element: no; Dropout Voltage(V): 0.34; Iout(mA): 3000; Isupply(mA): 1; Noise(uV): 40; Output Voltage: 3.3 V; PSRR(dB): 63; Shutdown Current(uA): 0.01; Vin Max(V): 20; Vin Min(V): 2.7; DatasheetVersion: Rev. B; PackageVersion: Rev. F, 09/2011; PackageReference: Q-5; PackageDescription: 5-Pin Plastic DD Pak, Body 10.2235 x 8.89 mm, Pitch 1.702 mm; Supplier 1: Digi-Key; Supplier Part Number 1: LT1764AEQ-3.3-ND; Supplier 2: Newark; Supplier Part Number 2: 57M6104; Number of Outputs: 1; RoHS: FALSE; Mounting Technology: Surface Mount; PartNumber: LT1764AEQ-3.3; ComponentLink1Description: Manufacturer URL; ComponentLink1URL: http://www.linear.com/; ComponentLink2Description: Datasheet; ComponentLink2URL: http://cds.linear.com/docs/en/datasheet/1764afb.pdf; ComponentLink3Description: Package Specification; ComponentLink3URL: http://cds.linear.com/docs/en/packaging/Q%20DD5%2005-08-1461%20Rev%20F.pdf
U17 = CAS 15-NP: Current Transducer, 5 V, -40 to 85 degC, 10-Pin THD, RoHS, Tray; Manufacturer: LEM; PartNumber: LTSR 15-NP; IP: 250 At; IPN: 15 At; G: 41.6 mV/A; VC: 5 V; CL: 500 pF Max.; Mounting Technology: Through Hole; ComponentLink1URL: http://www.lem.com/; ComponentLink3Description: Package Specification; DatasheetVersion: Feb-11; Packing: Tray; PackageDescription: 10-Pin THD, Body 22.2 x 9.3 mm, Height 24 mm; ComponentLink1Description: Manufacturer URL; ComponentLink3URL: http://www.lem.com/docs/products/ltsr%2015-np.pdf; Operating Temperature Range: -40 to 85 degC; ComponentLink2Description: Datasheet; ComponentLink2URL: http://www.lem.com/docs/products/ltsr%2015-np.pdf
U19 = CMP-0272-00853-3: Precision, 20 MHz, 0.9 pA Ib, RRIO, CMOS Operational Amplifier, 1.8 to 5.5 V, -40 to 125 degC, 5-pin SOT23 (DBV5), Green (RoHS & no Sb/Br); PartNumber: OPA320AIDBVR; Manufacturer: Texas Instruments; Vio (25C)(Max)(mV): 0.15; Number of Channels: 2; Slew Rate(Typ)(V/us): 10; CMRR(Min)(dB): 100; Sub Family: High Output Current Amplifier (>=50mA), Low Input Bias Current Amp (<=10pA), Low Noise Amp (<=10nV/rtHz), Low Offset Voltage Amplifier (<=500uV), Low Supply Voltage Amplifier (<=2.7V), Precision Amplifier; Total Supply Voltage(Min)(+5V is 5, +/-5V is 10): 1.8; Iq per channel(Max)(mA): 1.75; Vn at 1kHz(Typ)(nV/rtHz): 8.5; Offset Drift(Typ)(uV/C): 1.5; IIB(Max)(pA): 0.9; Total Supply Voltage(Max)(+5V is 5, +/-5V is 10): 5.5; PackageVersion: 4073253-4/K, 03/2006; Code_JEDEC: MO-178; ComponentLink2Description: Datasheet; PackageDescription: 5-Pin Plastic Small Outline, Body 1.6 x 2.9 mm, Pitch 0.95 mm; Eco-Plan: Green (RoHS & no Sb/Br); ComponentLink1Description: Manufacturer URL; Mounting Technology: Surface Mount; ComponentLink3Description: Package Specification; ComponentLink3URL: http://www.ti.com/litv/pdf/mpds018i; PackageReference: DBV0005A; ComponentLink2URL: http://www.ti.com/general/docs/lit/getliterature.tsp?genericPartNumber=OPA320&fileType=pdf; DatasheetVersion: SBOS513D; ComponentLink1URL: http://www.ti.com/
U20 = CMP-1679-00012-1: Low Noise Low Drop Out (LDO) Linear Voltage Regulator, 3.3 V Output Voltage, 150 mA, -40 to 85 degC, 5-Pin SOT-23 (1212-01), Pb-Free, Tape and Reel; ComponentLink2Description: Datasheet; PackageDescription: 5-Pin Small Outline Transistor, Body 2.9 x 1.65 mm, Pitch 0.95 mm; ComponentLink1Description: Manufacturer URL; DatasheetVersion: Rev. 6, 06/2005; ComponentLink2URL: http://www.onsemi.com/pub_link/Collateral/MC78PC00-D.PDF; ComponentLink1URL: http://www.onsemi.com/; PackageReference: SOT-23-5-1212-01_O
U21 = CMP-0272-01600-3: Ultra-Low Noise Precision Operational Amplifier, 8 to 44 V, -40 to 85 degC, 8-pin DIP (P8), Green (RoHS & no Sb/Br); Manufacturer: Texas Instruments; Total Supply Voltage(Max)(+5V is 5, +/-5V is 10): 44; Total Supply Voltage(Min)(+5V is 5, +/-5V is 10): 8; CMRR(Min)(dB): 100; Number of Channels: 1; Slew Rate(Typ)(V/us): 1.9; Packing: TUBE; Iq per channel(Max)(mA): 5.7; Sub Family: High Supply Voltage Amplifier (>=30V), Low Noise Amp (<=10nV/rtHz), Low Offset Voltage Amplifier (<=500uV), Precision Amplifier; Vio (25C)(Max)(mV): 0.1; IIB(Max)(pA): 80000; Offset Drift(Typ)(uV/C): 0.4; Rating: Catalog; PackageReference: P0008A; ComponentLink2Description: Datasheet; ComponentLink3URL: http://www.ti.com/litv/pdf/mpdi001b; PackageVersion: 4040082/E, 04/2010; ComponentLink3Description: Package Specification; ComponentLink1URL: http://www.ti.com/; Eco-Plan: Green (RoHS & no Sb/Br); Mounting Technology: Through Hole; ComponentLink1Description: Manufacturer URL; PackageDescription: 8-Pin Plastic In-Line, Body 9.59 x 6.35 mm, Pitch 2.54 mm; PartNumber: OPA27GP; Code_JEDEC: MS-001; ComponentLink2URL: http://www.ti.com/lit/ds/symlink/opa27.pdf; DatasheetVersion: SBOS135C; GBW(Typ)(MHz): 8